# EAGLE design RFWBBoard (EAGLE 6.1)
AUTHOR: Benjamin Babjak; AUTHOREMAIL: benjamin.babjak@vanderbilt.edu; PAGE1: Cover page; PAGE2: Connector; PAGE3: Baseband signals; PAGE4: RF signals; PAGE5: Control/Digital signals; PAGE6: Clock; PAGE7: Supply; REVIEWER1: Peter Volgyesi; REVIEWER2: Sandor Szilvasi; REVIEWEREMAIL1: peter.volgyesi@vanderbilt.edu; REVIEWEREMAIL2: sandor.szilvasi@vanderbilt.edu; REVISION: A; TITLE: Joshua

## Sheet 1 of 7
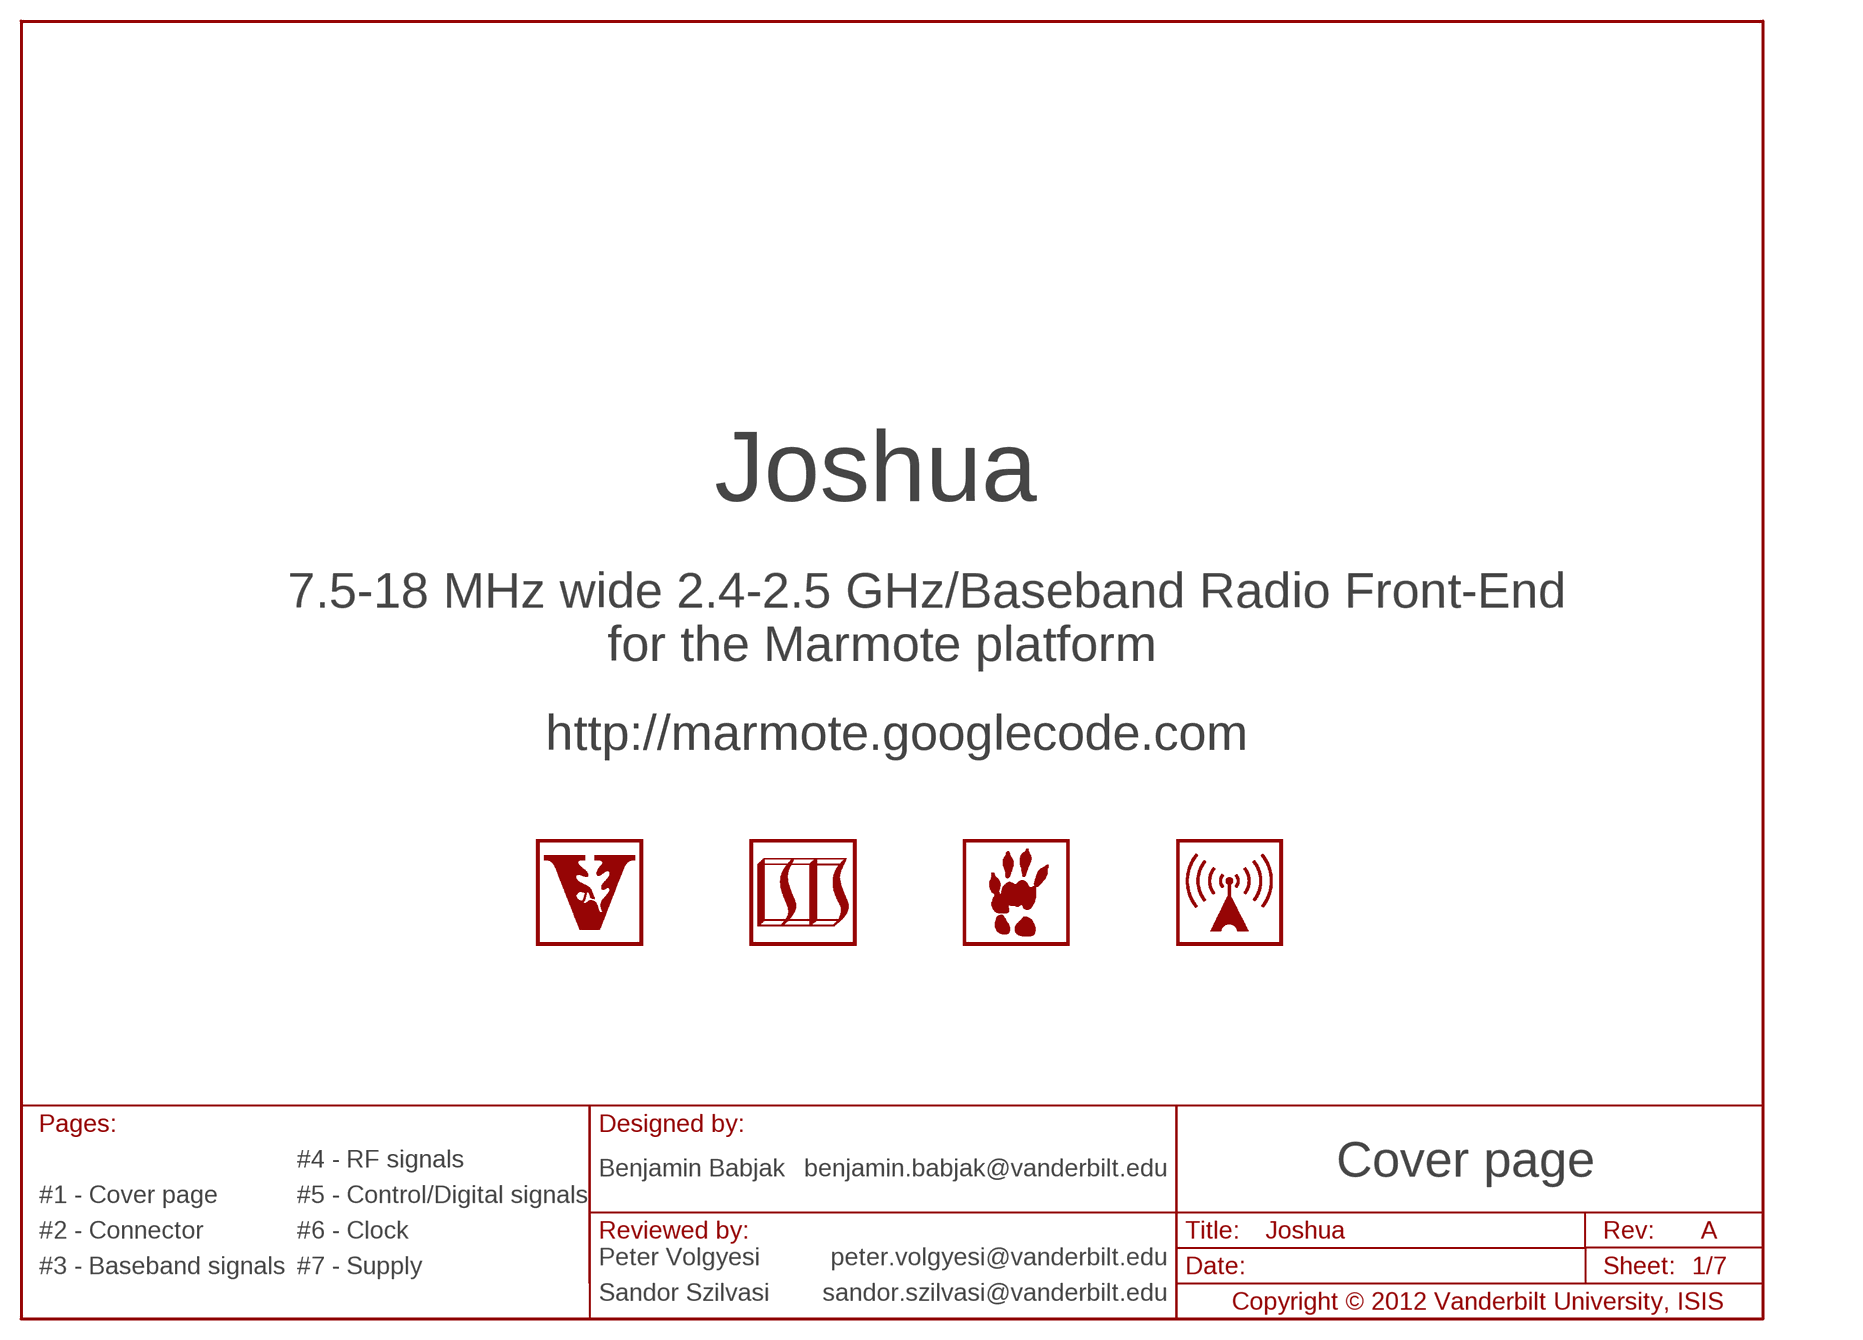
[diagram p0: schematic, sheet 1]

### Parts
LOGO4  LOGO-ISIS-600MIL-10MM-SS  [LOGO-ISIS-10MM-SILKSCREEN]
LOGO5  LOGO-VANDERBILT-600MIL-10MM-SS  [LOGO-VANDERBILT-10MM-SILKSCREEN]
LOGO6  LOGO-MARMOTE-600MIL-10MM-SS  [LOGO-MARMOTE-10MM-SILKSCREEN]
LOGO7  LOGO-RADIO-3-600MIL-10MM-SS  [LOGO-RADIO-FILLED-10MM-SILKSCREEN]

### Notes on the sheet
- 7.5-18 MHz wide 2.4-2.5 GHz/Baseband Radio Front-End
- for the Marmote platform
- http://marmote.googlecode.com

## Sheet 2 of 7
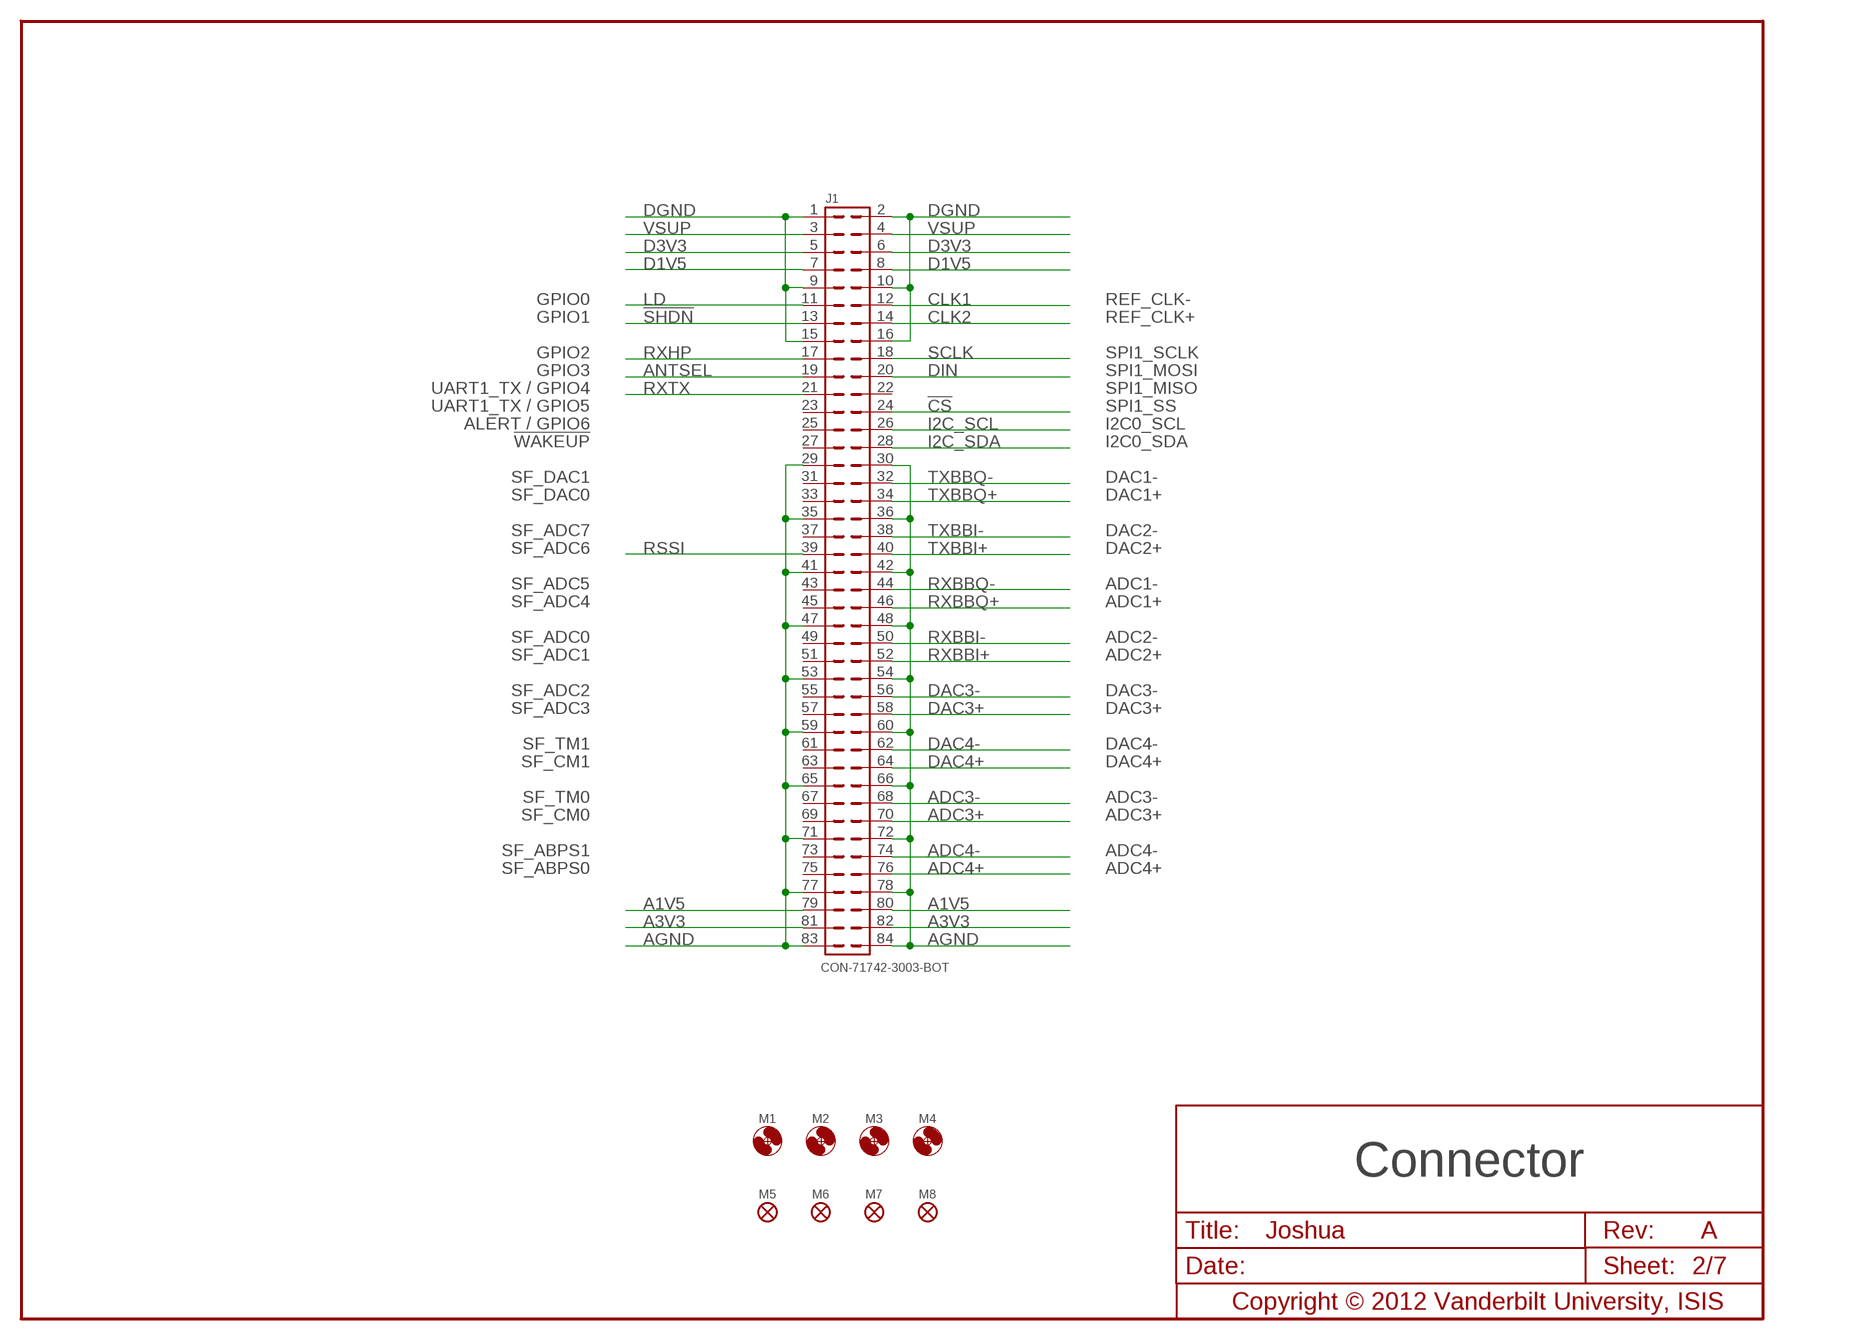
[diagram p1: schematic, sheet 2]

### Parts
J1  CON-71742-3003-BOT  [71742-3003-BOT]
M1  MOUNT-HOLE3.3  [3,3]
M2  MOUNT-HOLE3.3  [3,3]
M3  MOUNT-HOLE3.3  [3,3]
M4  MOUNT-HOLE3.3  [3,3]
M5  FIDUCIAL1X2  [FIDUCIAL-1X2]
M6  FIDUCIAL1X2  [FIDUCIAL-1X2]
M7  FIDUCIAL1X2  [FIDUCIAL-1X2]
M8  FIDUCIAL1X2  [FIDUCIAL-1X2]

### Nets
!CS: J1.24 ; also sheet 5
!SHDN: J1.13 ; also sheet 5
A1V5: J1.79 J1.80
A3V3: J1.81 J1.82 ; also sheet 3,6,7
ADC3+: J1.70 ; also sheet 3
ADC3-: J1.68 ; also sheet 3
ADC4+: J1.76 ; also sheet 3
ADC4-: J1.74 ; also sheet 3
AGND: J1.29 J1.30 J1.35 J1.36 J1.41 J1.42 J1.47 J1.48 J1.53 J1.54 J1.59 J1.60 J1.65 J1.66 J1.71 J1.72 J1.77 J1.78 J1.83 J1.84 ; also sheet 3,4,6,7
ANTSEL: J1.19 ; also sheet 5
CLK1: J1.12 ; also sheet 6
CLK2: J1.14 ; also sheet 6
D1V5: J1.7 J1.8
D3V3: J1.5 J1.6 ; also sheet 5
DAC3+: J1.58 ; also sheet 3
DAC3-: J1.56 ; also sheet 3
DAC4+: J1.64 ; also sheet 3
DAC4-: J1.62 ; also sheet 3
DGND: J1.1 J1.2 J1.9 J1.10 J1.15 J1.16 ; also sheet 5,6,7
DIN: J1.20 ; also sheet 5
I2C_SCL: J1.26 ; also sheet 5
I2C_SDA: J1.28 ; also sheet 5
LD: J1.11 ; also sheet 6
RSSI: J1.39 ; also sheet 5
RXBBI+: J1.52 ; also sheet 4
RXBBI-: J1.50 ; also sheet 4
RXBBQ+: J1.46 ; also sheet 4
RXBBQ-: J1.44 ; also sheet 4
RXHP: J1.17 ; also sheet 5
RXTX: J1.21 ; also sheet 5
SCLK: J1.18 ; also sheet 5
TXBBI+: J1.40 ; also sheet 4
TXBBI-: J1.38 ; also sheet 4
TXBBQ+: J1.34 ; also sheet 4
TXBBQ-: J1.32 ; also sheet 4
VSUP: J1.3 J1.4
Unconnected: J1.22 J1.23 J1.25 J1.27 J1.31 J1.33 J1.37 J1.43 J1.45 J1.49 J1.51 J1.55 J1.57 J1.61 J1.63 J1.67 J1.69 J1.73 J1.75

### Notes on the sheet
- GPIO0 | REF_CLK-
- GPIO1 | REF_CLK+
- GPIO2 | SPI1_SCLK
- GPIO3 | SPI1_MOSI
- UART1_TX / GPIO4 | SPI1_MISO
- UART1_TX / GPIO5 | SPI1_SS
- ALERT / GPIO6 | I2C0_SCL
- !WAKEUP | I2C0_SDA
- SF_DAC1 | DAC1-
- SF_DAC0 | DAC1+
- SF_ADC7 | DAC2-
- SF_ADC6 | DAC2+
- SF_ADC5 | ADC1-
- SF_ADC4 | ADC1+
- SF_ADC0 | ADC2-
- SF_ADC1 | ADC2+
- SF_ADC2 | DAC3-
- SF_ADC3 | DAC3+
- SF_TM1 | DAC4-
- SF_CM1 | DAC4+
- SF_TM0 | ADC3-
- SF_CM0 | ADC3+
- SF_ABPS1 | ADC4-
- SF_ABPS0 | ADC4+

## Sheet 3 of 7
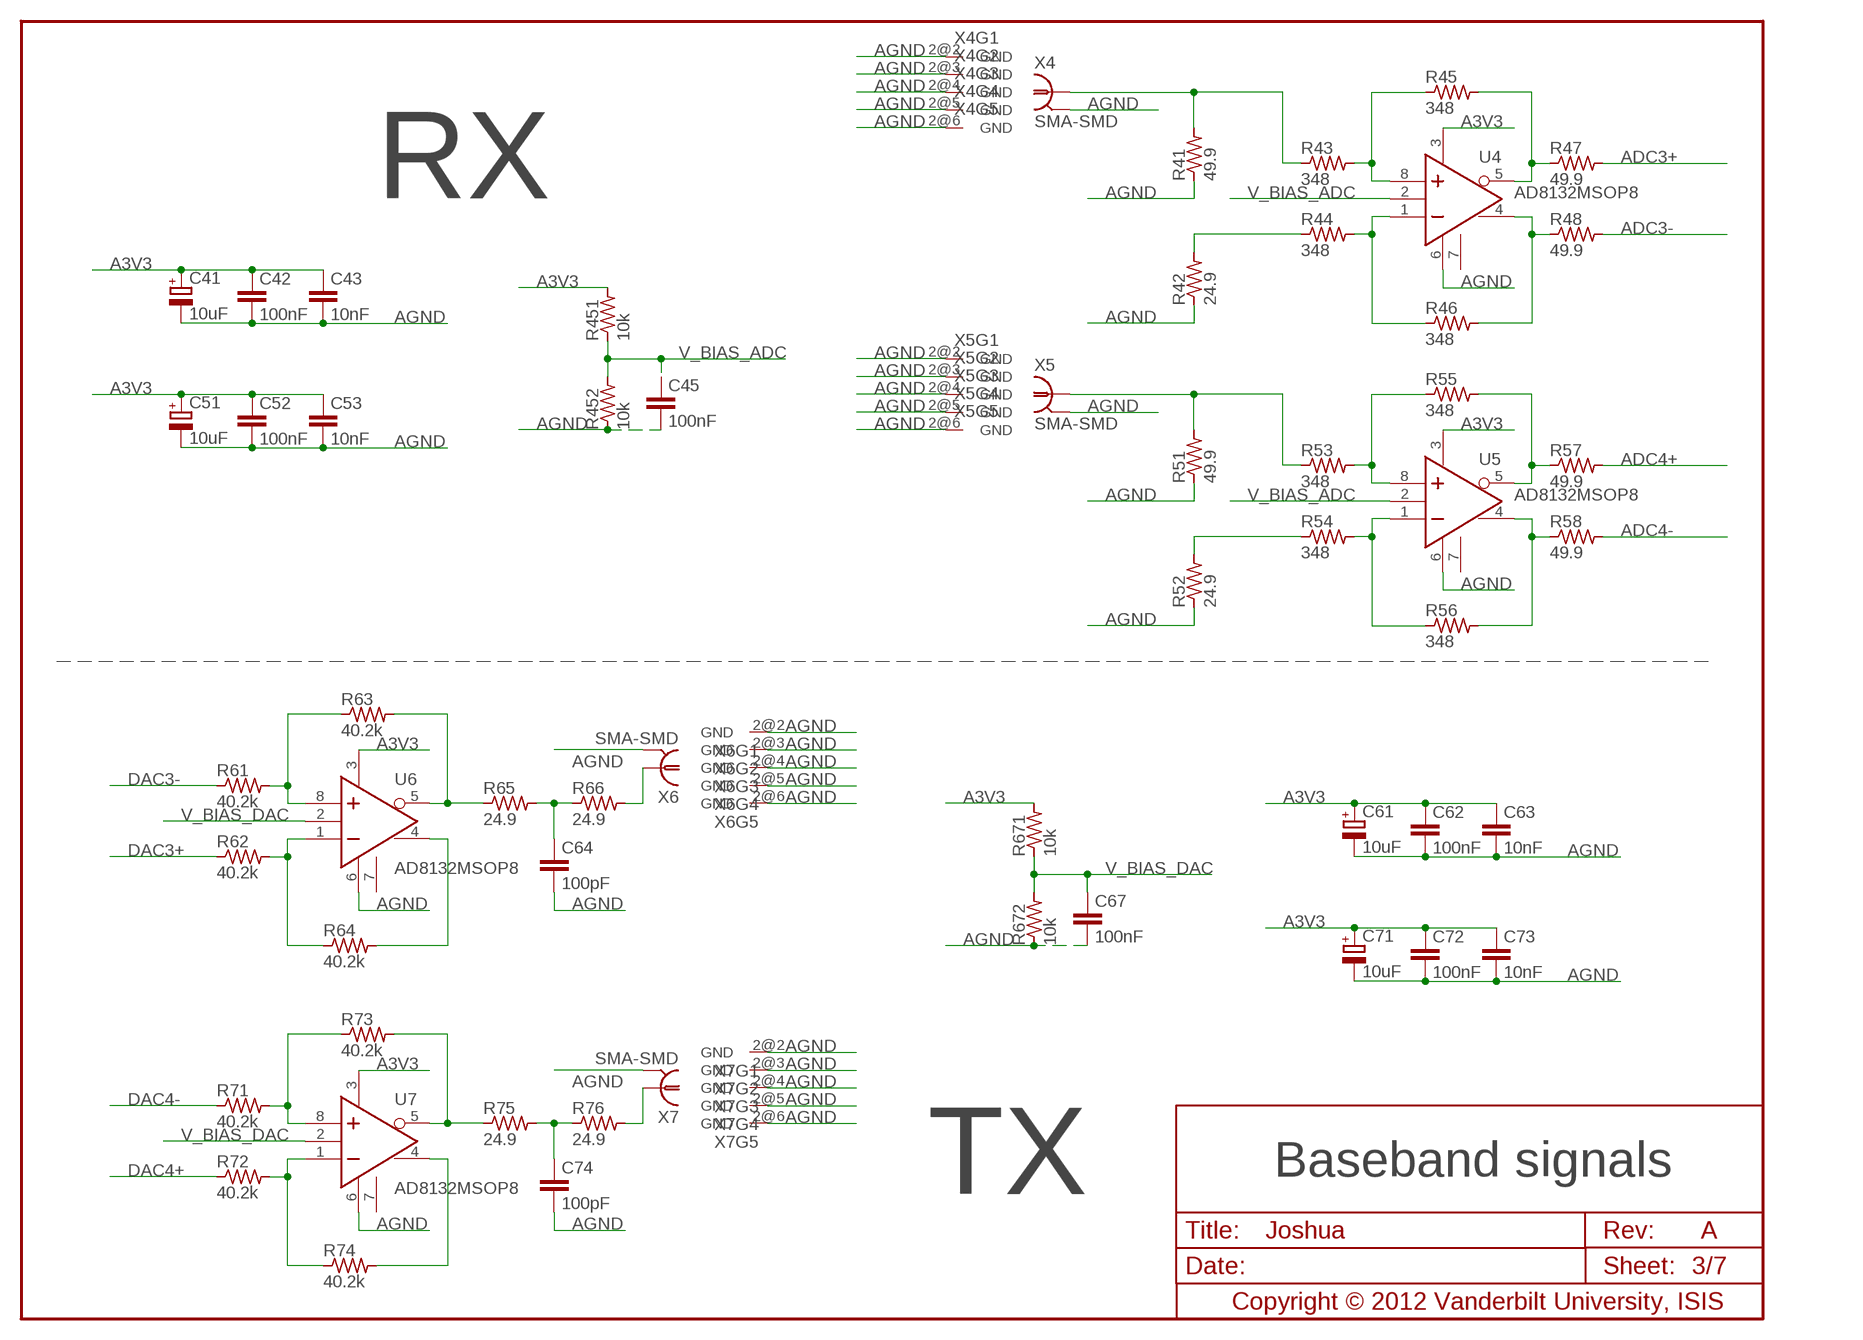
[diagram p2: schematic, sheet 3]

### Parts
C41  10uF  CPOL2012  [CPOL2012]
C42  100nF  C0402  [C0402]
C43  10nF  C0402  [C0402]
C45  100nF  C0402  [C0402]
C51  10uF  CPOL2012  [CPOL2012]
C52  100nF  C0402  [C0402]
C53  10nF  C0402  [C0402]
C61  10uF  CPOL2012  [CPOL2012]
C62  100nF  C0402  [C0402]
C63  10nF  C0402  [C0402]
C64  100pF  C0402  [C0402]
C67  100nF  C0402  [C0402]
C71  10uF  CPOL2012  [CPOL2012]
C72  100nF  C0402  [C0402]
C73  10nF  C0402  [C0402]
C74  100pF  C0402  [C0402]
R41  49.9  R0402  [R0402]
R42  24.9  R0402  [R0402]
R43  348  R0402  [R0402]
R44  348  R0402  [R0402]
R45  348  R0402  [R0402]
R46  348  R0402  [R0402]
R47  49.9  R0402  [R0402]
R48  49.9  R0402  [R0402]
R51  49.9  R0402  [R0402]
R52  24.9  R0402  [R0402]
R53  348  R0402  [R0402]
R54  348  R0402  [R0402]
R55  348  R0402  [R0402]
R56  348  R0402  [R0402]
R57  49.9  R0402  [R0402]
R58  49.9  R0402  [R0402]
R61  40.2k  R0402  [R0402]
R62  40.2k  R0402  [R0402]
R63  40.2k  R0402  [R0402]
R64  40.2k  R0402  [R0402]
R65  24.9  R0402  [R0402]
R66  24.9  R0402  [R0402]
R71  40.2k  R0402  [R0402]
R72  40.2k  R0402  [R0402]
R73  40.2k  R0402  [R0402]
R74  40.2k  R0402  [R0402]
R75  24.9  R0402  [R0402]
R76  24.9  R0402  [R0402]
R451  10k  R0402  [R0402]
R452  10k  R0402  [R0402]
R671  10k  R0402  [R0402]
R672  10k  R0402  [R0402]
U4  AD8132MSOP8  [MSOP8]
U5  AD8132MSOP8  [MSOP8]
U6  AD8132MSOP8  [MSOP8]
U7  AD8132MSOP8  [MSOP8]
X4  SMA-SMD  [SMA-SMD]
X5  SMA-SMD  [SMA-SMD]
X6  SMA-SMD  [SMA-SMD]
X7  SMA-SMD  [SMA-SMD]

### Nets
A3V3: C41.+ C42.1 C43.1 C51.+ C52.1 C53.1 C61.+ C62.1 C63.1 C71.+ C72.1 C73.1 R451.2 R671.2 U4.3(V_S+) U5.3(V_S+) U6.3(V_S+) U7.3(V_S+) ; also sheet 2,6,7
ADC3+: R47.2 ; also sheet 2
ADC3-: R48.2 ; also sheet 2
ADC4+: R57.2 ; also sheet 2
ADC4-: R58.2 ; also sheet 2
AGND: C41.- C42.2 C43.2 C45.2 C51.- C52.2 C53.2 C61.- C62.2 C63.2 C64.2 C67.2 C71.- C72.2 C73.2 C74.2 R41.1 R42.1 R51.1 R52.1 R452.1 R672.1 U4.6(V_S-) U5.6(V_S-) U6.6(V_S-) U7.6(V_S-) X4.2@1(GND) X4.2@2(GND) X4.2@3(GND) X4.2@4(GND) X4.2@5(GND) X4.2@6(GND) X5.2@1(GND) X5.2@2(GND) X5.2@3(GND) X5.2@4(GND) X5.2@5(GND) X5.2@6(GND) X6.2@1(GND) X6.2@2(GND) X6.2@3(GND) X6.2@4(GND) X6.2@5(GND) X6.2@6(GND) X7.2@1(GND) X7.2@2(GND) X7.2@3(GND) X7.2@4(GND) X7.2@5(GND) X7.2@6(GND) ; also sheet 2,4,6,7
DAC3+: R62.1 ; also sheet 2
DAC3-: R61.1 ; also sheet 2
DAC4+: R72.1 ; also sheet 2
DAC4-: R71.1 ; also sheet 2
N$11: R41.2 R43.1 X4.1
N$12: R45.2 R47.1 U4.5(-OUT)
N$13: R46.2 R48.1 U4.4(+OUT)
N$14: R43.2 R45.1 U4.8(+IN)
N$15: R44.2 R46.1 U4.1(-IN)
N$16: R51.2 R53.1 X5.1
N$17: R42.2 R44.1
N$18: R55.2 R57.1 U5.5(-OUT)
N$19: R56.2 R58.1 U5.4(+OUT)
N$20: R53.2 R55.1 U5.8(+IN)
N$21: R54.2 R56.1 U5.1(-IN)
N$22: R52.2 R54.1
N$23: R61.2 R63.1 U6.8(+IN)
N$24: R62.2 R64.1 U6.1(-IN)
N$25: R63.2 R65.1 U6.5(-OUT)
N$26: R64.2 U6.4(+OUT)
N$27: C64.1 R65.2 R66.1
N$28: R71.2 R73.1 U7.8(+IN)
N$29: R66.2 X6.1
N$30: R72.2 R74.1 U7.1(-IN)
N$31: R73.2 R75.1 U7.5(-OUT)
N$32: R74.2 U7.4(+OUT)
N$33: C74.1 R75.2 R76.1
N$34: R76.2 X7.1
V_BIAS_ADC: C45.1 R451.1 R452.2 U4.2(V_OCM) U5.2(V_OCM)
V_BIAS_DAC: C67.1 R671.1 R672.2 U6.2(V_OCM) U7.2(V_OCM)
Unconnected: U4.7(PD) U5.7(PD) U6.7(PD) U7.7(PD)

### Notes on the sheet
- RX
- TX

## Sheet 4 of 7
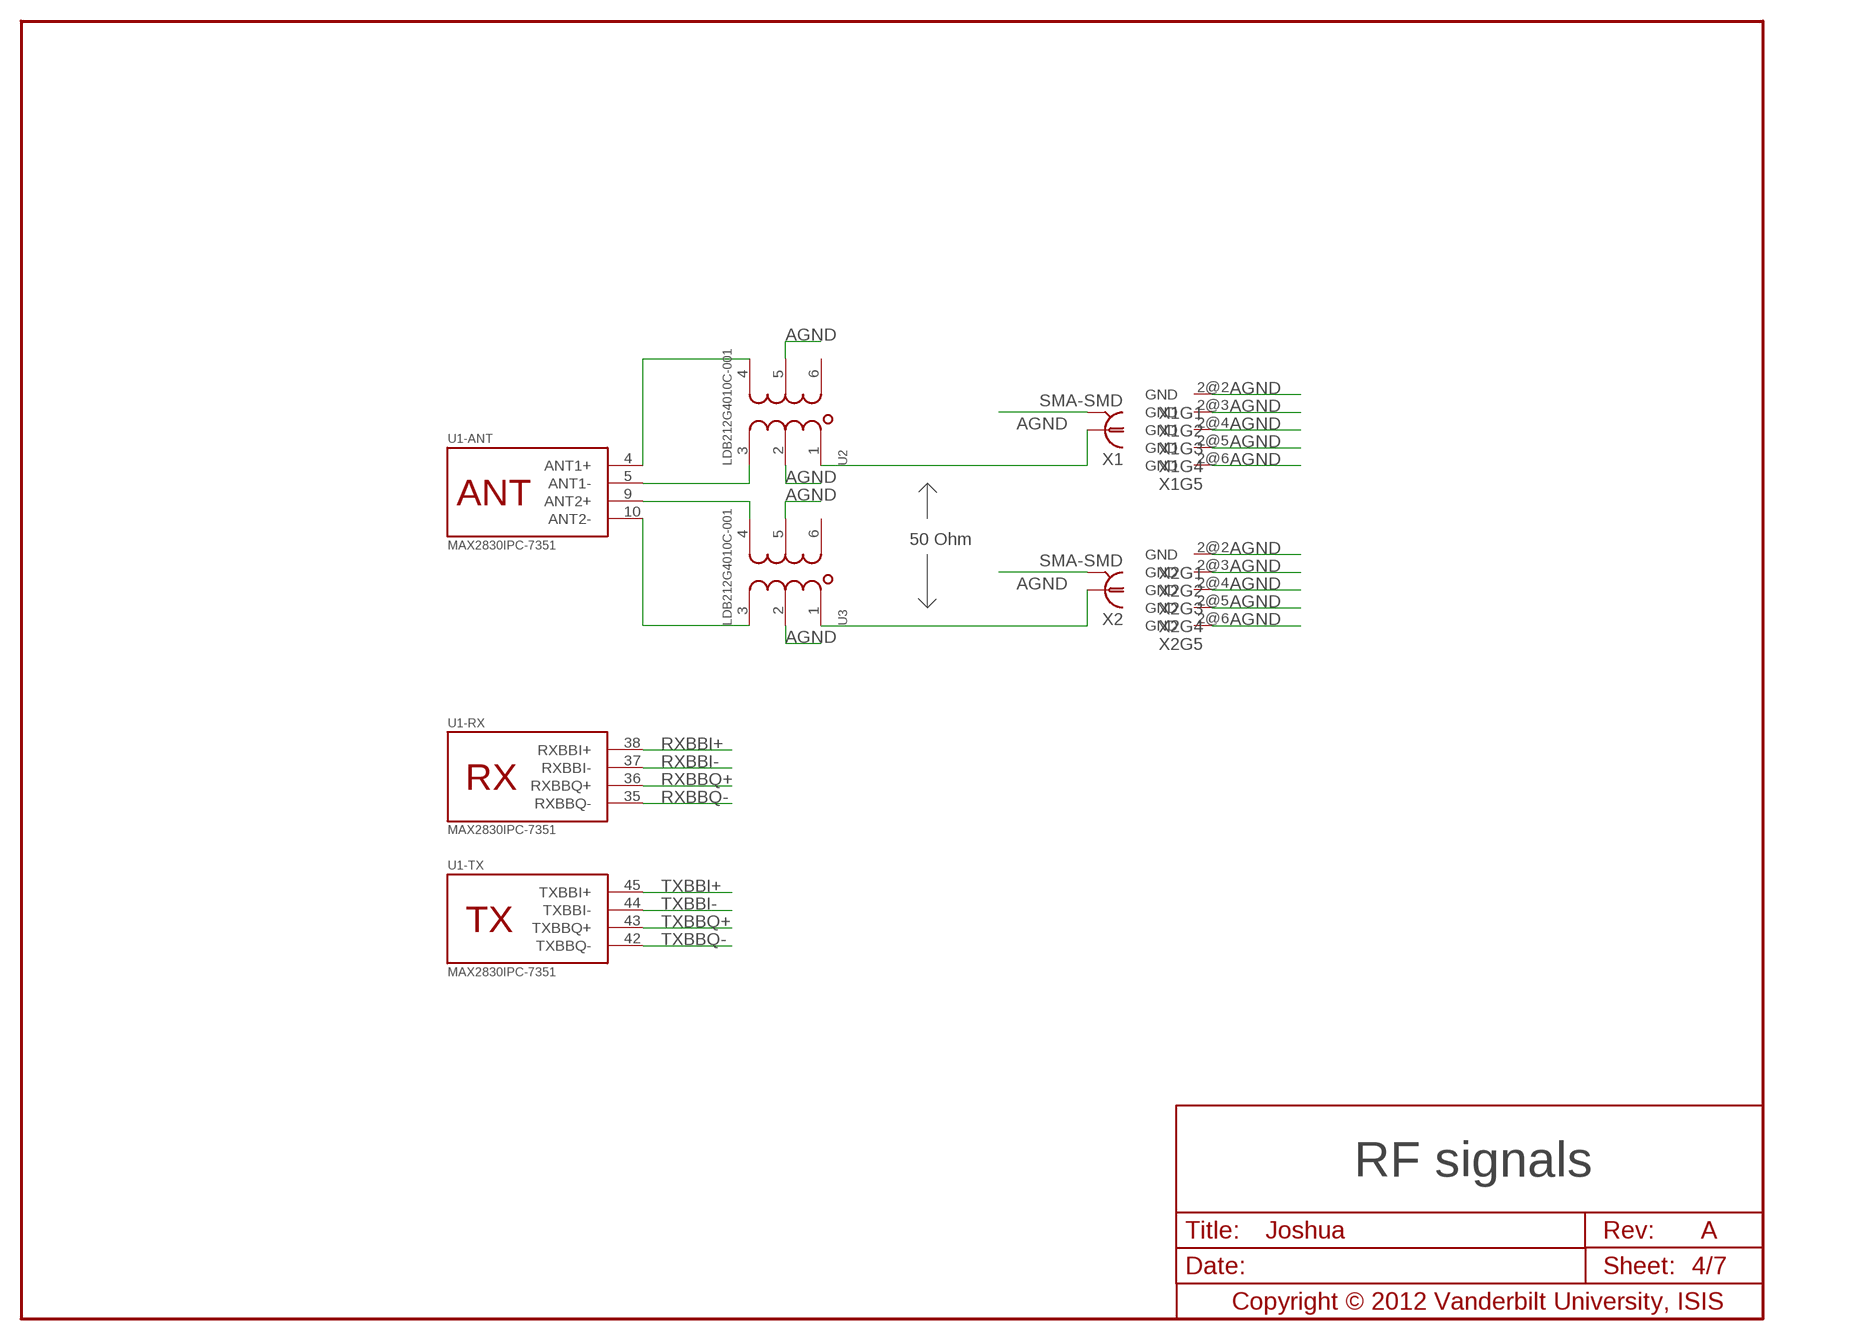
[diagram p3: schematic, sheet 4]

### Parts
U1  MAX2830IPC-7351  [TQFN-48]
U2  LDB212G4010C-001  [LDB21-FOOTPRINT]
U3  LDB212G4010C-001  [LDB21-FOOTPRINT]
X1  SMA-SMD  [SMA-SMD]
X2  SMA-SMD  [SMA-SMD]

### Nets
AGND: U2.2 U2.5 U3.2 U3.5 X1.2@1(GND) X1.2@2(GND) X1.2@3(GND) X1.2@4(GND) X1.2@5(GND) X1.2@6(GND) X2.2@1(GND) X2.2@2(GND) X2.2@3(GND) X2.2@4(GND) X2.2@5(GND) X2.2@6(GND) ; also sheet 2,3,6,7
N$1: U1.4(-ANT:ANT1+) U2.4
N$2: U1.5(-ANT:ANT1-) U2.3
N$3: U1.10(-ANT:ANT2-) U3.3
N$4: U1.9(-ANT:ANT2+) U3.4
N$8: U2.1 X1.1
N$9: U3.1 X2.1
RXBBI+: U1.38(-RX:RXBBI+) ; also sheet 2
RXBBI-: U1.37(-RX:RXBBI-) ; also sheet 2
RXBBQ+: U1.36(-RX:RXBBQ+) ; also sheet 2
RXBBQ-: U1.35(-RX:RXBBQ-) ; also sheet 2
TXBBI+: U1.45(-TX:TXBBI+) ; also sheet 2
TXBBI-: U1.44(-TX:TXBBI-) ; also sheet 2
TXBBQ+: U1.43(-TX:TXBBQ+) ; also sheet 2
TXBBQ-: U1.42(-TX:TXBBQ-) ; also sheet 2
Unconnected: U2.6 U3.6

### Notes on the sheet
- 50 Ohm

## Sheet 5 of 7
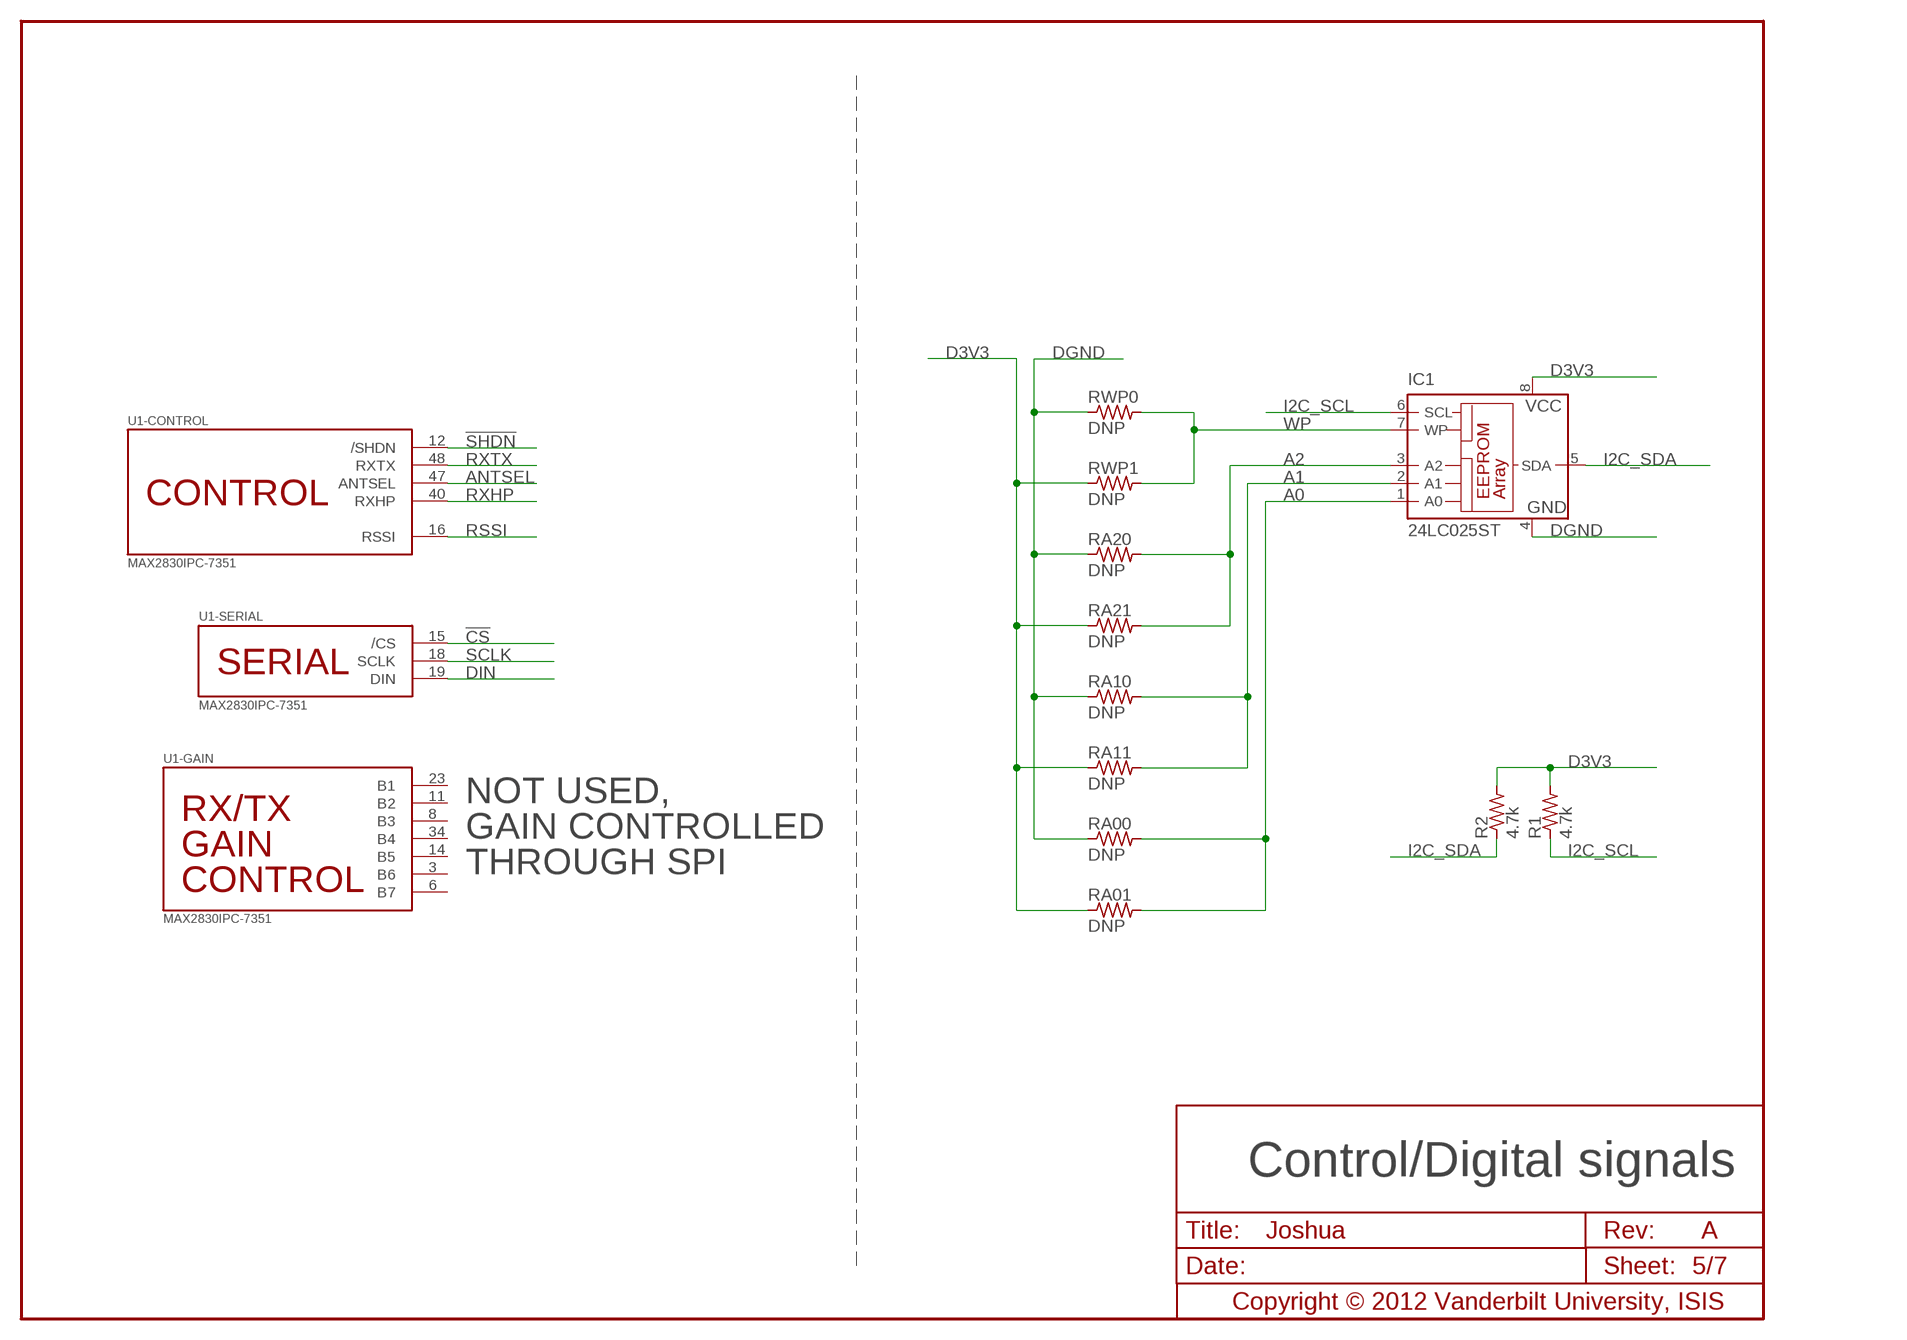
[diagram p4: schematic, sheet 5]

### Parts
IC1  24LC025ST  [TSSOP8]
R1  4.7k  R0402  [R0402]
R2  4.7k  R0402  [R0402]
RA00  DNP  R0402  [R0402]
RA01  DNP  R0402  [R0402]
RA10  DNP  R0402  [R0402]
RA11  DNP  R0402  [R0402]
RA20  DNP  R0402  [R0402]
RA21  DNP  R0402  [R0402]
RWP0  DNP  R0402  [R0402]
RWP1  DNP  R0402  [R0402]

### Nets
!CS: U1.15(-SERIAL:/CS) ; also sheet 2
!SHDN: U1.12(-CONTROL:/SHDN) ; also sheet 2
A0: IC1.1(A0) RA00.2 RA01.2
A1: IC1.2(A1) RA10.2 RA11.2
A2: IC1.3(A2) RA20.2 RA21.2
ANTSEL: U1.47(-CONTROL:ANTSEL) ; also sheet 2
D3V3: IC1.8(VCC) R1.2 R2.2 RA01.1 RA11.1 RA21.1 RWP1.1 ; also sheet 2
DGND: IC1.4(GND) RA00.1 RA10.1 RA20.1 RWP0.1 ; also sheet 2,6,7
DIN: U1.19(-SERIAL:DIN) ; also sheet 2
I2C_SCL: IC1.6(SCL) R1.1 ; also sheet 2
I2C_SDA: IC1.5(SDA) R2.1 ; also sheet 2
RSSI: U1.16(-CONTROL:RSSI) ; also sheet 2
RXHP: U1.40(-CONTROL:RXHP) ; also sheet 2
RXTX: U1.48(-CONTROL:RXTX) ; also sheet 2
SCLK: U1.18(-SERIAL:SCLK) ; also sheet 2
WP: IC1.7(WP) RWP0.2 RWP1.2
Unconnected: U1.3(-GAIN:B6) U1.6(-GAIN:B7) U1.8(-GAIN:B3) U1.11(-GAIN:B2) U1.14(-GAIN:B5) U1.23(-GAIN:B1) U1.34(-GAIN:B4)

### Notes on the sheet
- NOT USED,
- GAIN CONTROLLED
- THROUGH SPI

## Sheet 6 of 7
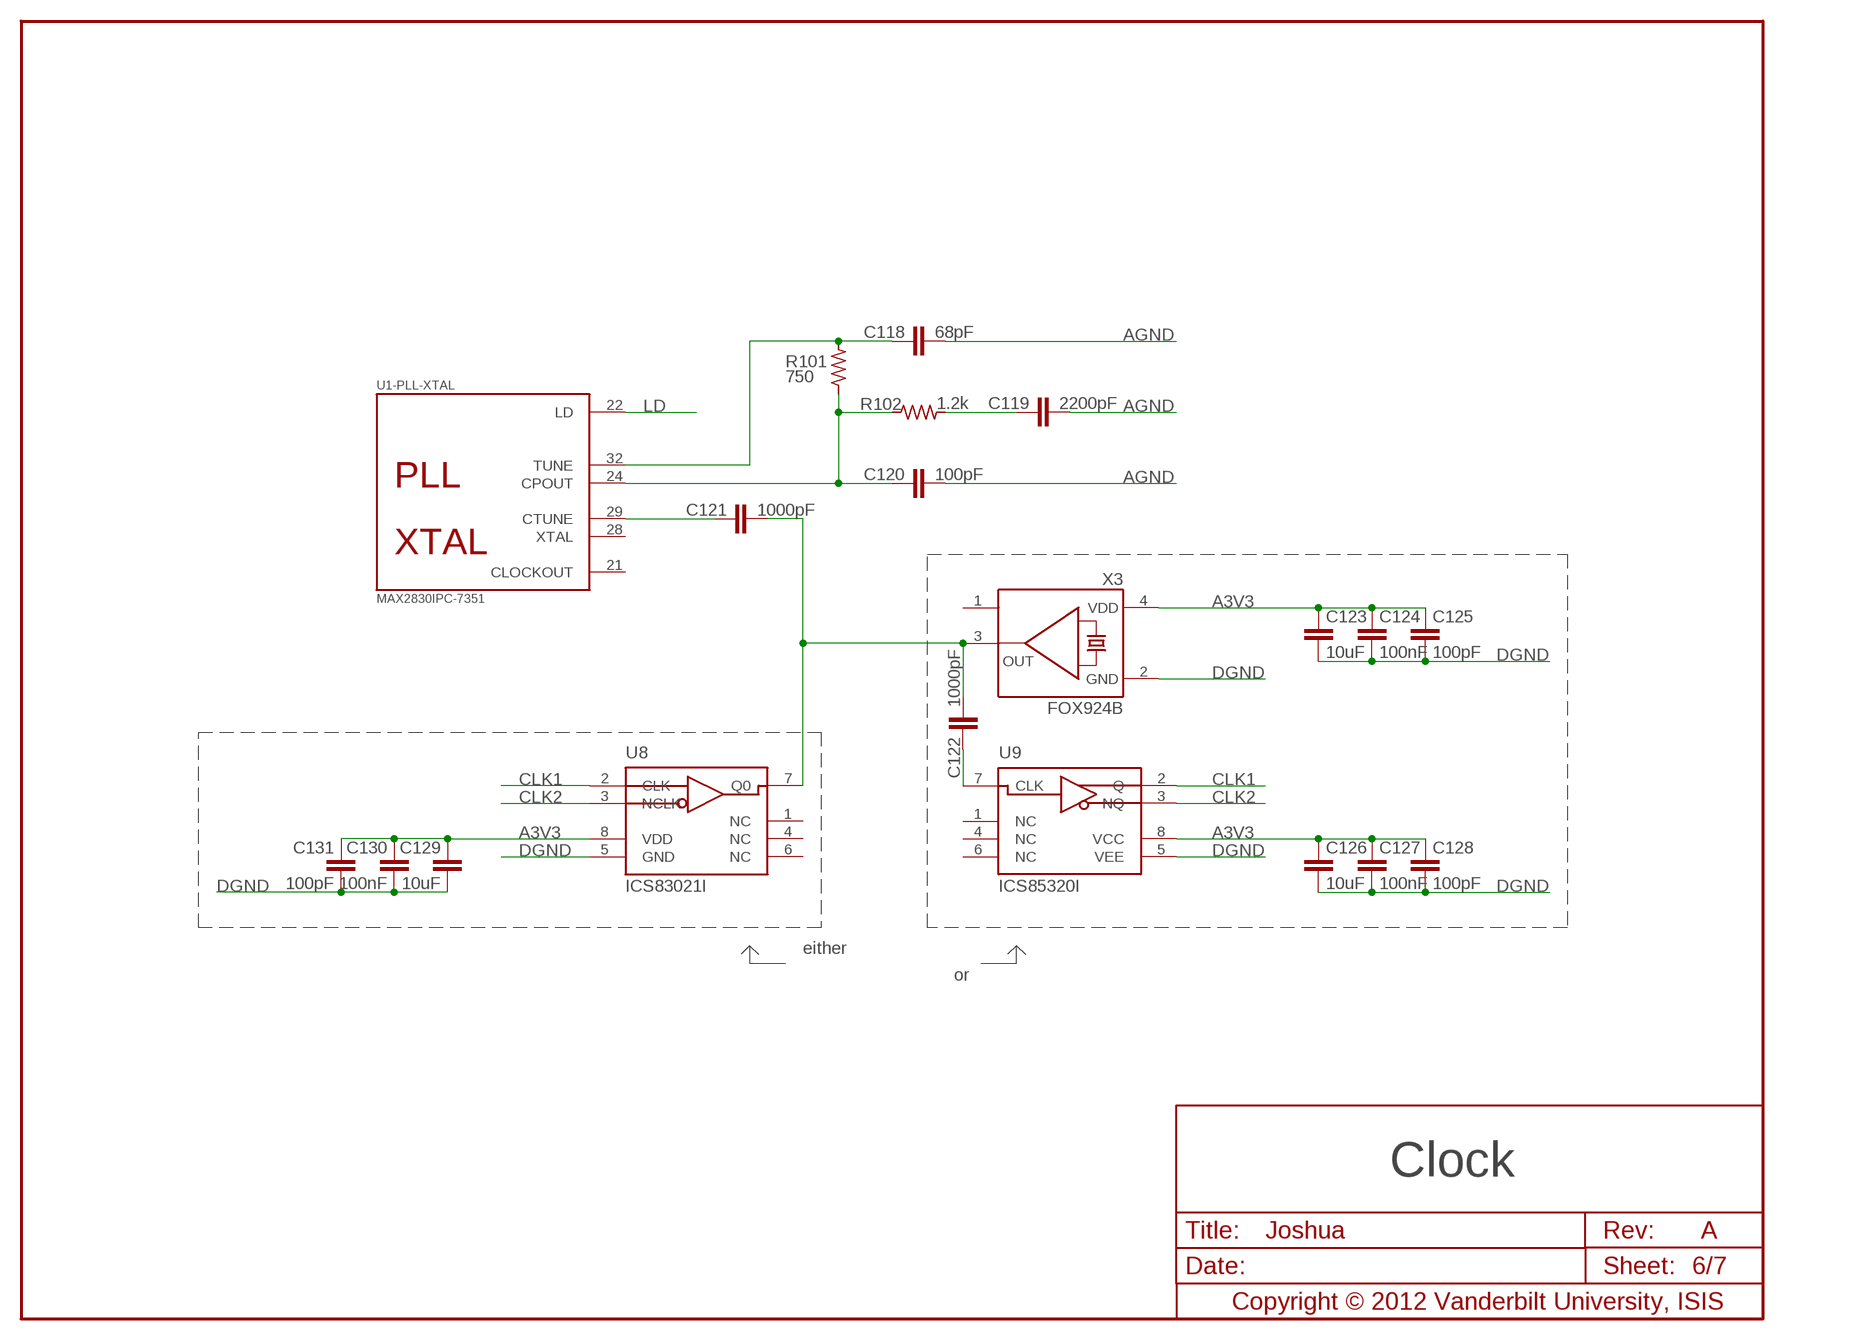
[diagram p5: schematic, sheet 6]

### Parts
C118  68pF  C0402  [C0402]
C119  2200pF  C0402  [C0402]
C120  100pF  C0402  [C0402]
C121  1000pF  C0402  [C0402]
C122  1000pF  C0402  [C0402]
C123  10uF  C0805  [C0805]
C124  100nF  C0402  [C0402]
C125  100pF  C0402  [C0402]
C126  10uF  C0805  [C0805]
C127  100nF  C0402  [C0402]
C128  100pF  C0402  [C0402]
C129  10uF  C0805  [C0805]
C130  100nF  C0402  [C0402]
C131  100pF  C0402  [C0402]
R101  750  R0402  [R0402]
R102  1.2k  R0402  [R0402]
U8  ICS83021I  [SOIC8]
U9  ICS85320I  [SOIC8]
X3  FOX924B  [FOX924]

### Nets
A3V3: C123.1 C124.1 C125.1 C126.1 C127.1 C128.1 C129.1 C130.1 C131.1 U8.8(VDD) U9.8(VCC) X3.4(VCC) ; also sheet 2,3,7
AGND: C118.2 C119.2 C120.2 ; also sheet 2,3,4,7
CLK1: U8.2(CLK) U9.2(Q) ; also sheet 2
CLK2: U8.3(NCLK) U9.3(NQ) ; also sheet 2
DGND: C123.2 C124.2 C125.2 C126.2 C127.2 C128.2 C129.2 C130.2 C131.2 U8.5(GND) U9.5(VEE) X3.2(GND) ; also sheet 2,5,7
LD: U1.22(-PLL-XTAL:LD) ; also sheet 2
N$5: C118.1 R101.2 U1.32(-PLL-XTAL:TUNE)
N$6: C121.1 U1.29(-PLL-XTAL:CTUNE)
N$7: C119.1 R102.2
N$10: C120.1 R101.1 R102.1 U1.24(-PLL-XTAL:CPOUT)
N$36: C121.2 C122.2 U8.7(Q0) X3.3(FO)
N$39: C122.1 U9.7(CLK)
Unconnected: U1.21(-PLL-XTAL:CLOCKOUT) U1.28(-PLL-XTAL:XTAL) U8.1(NC) U8.4(NC) U8.6(NC) U9.1(NC) U9.4(NC) U9.6(NC) X3.1(NC)

### Notes on the sheet
- either
- or

## Sheet 7 of 7
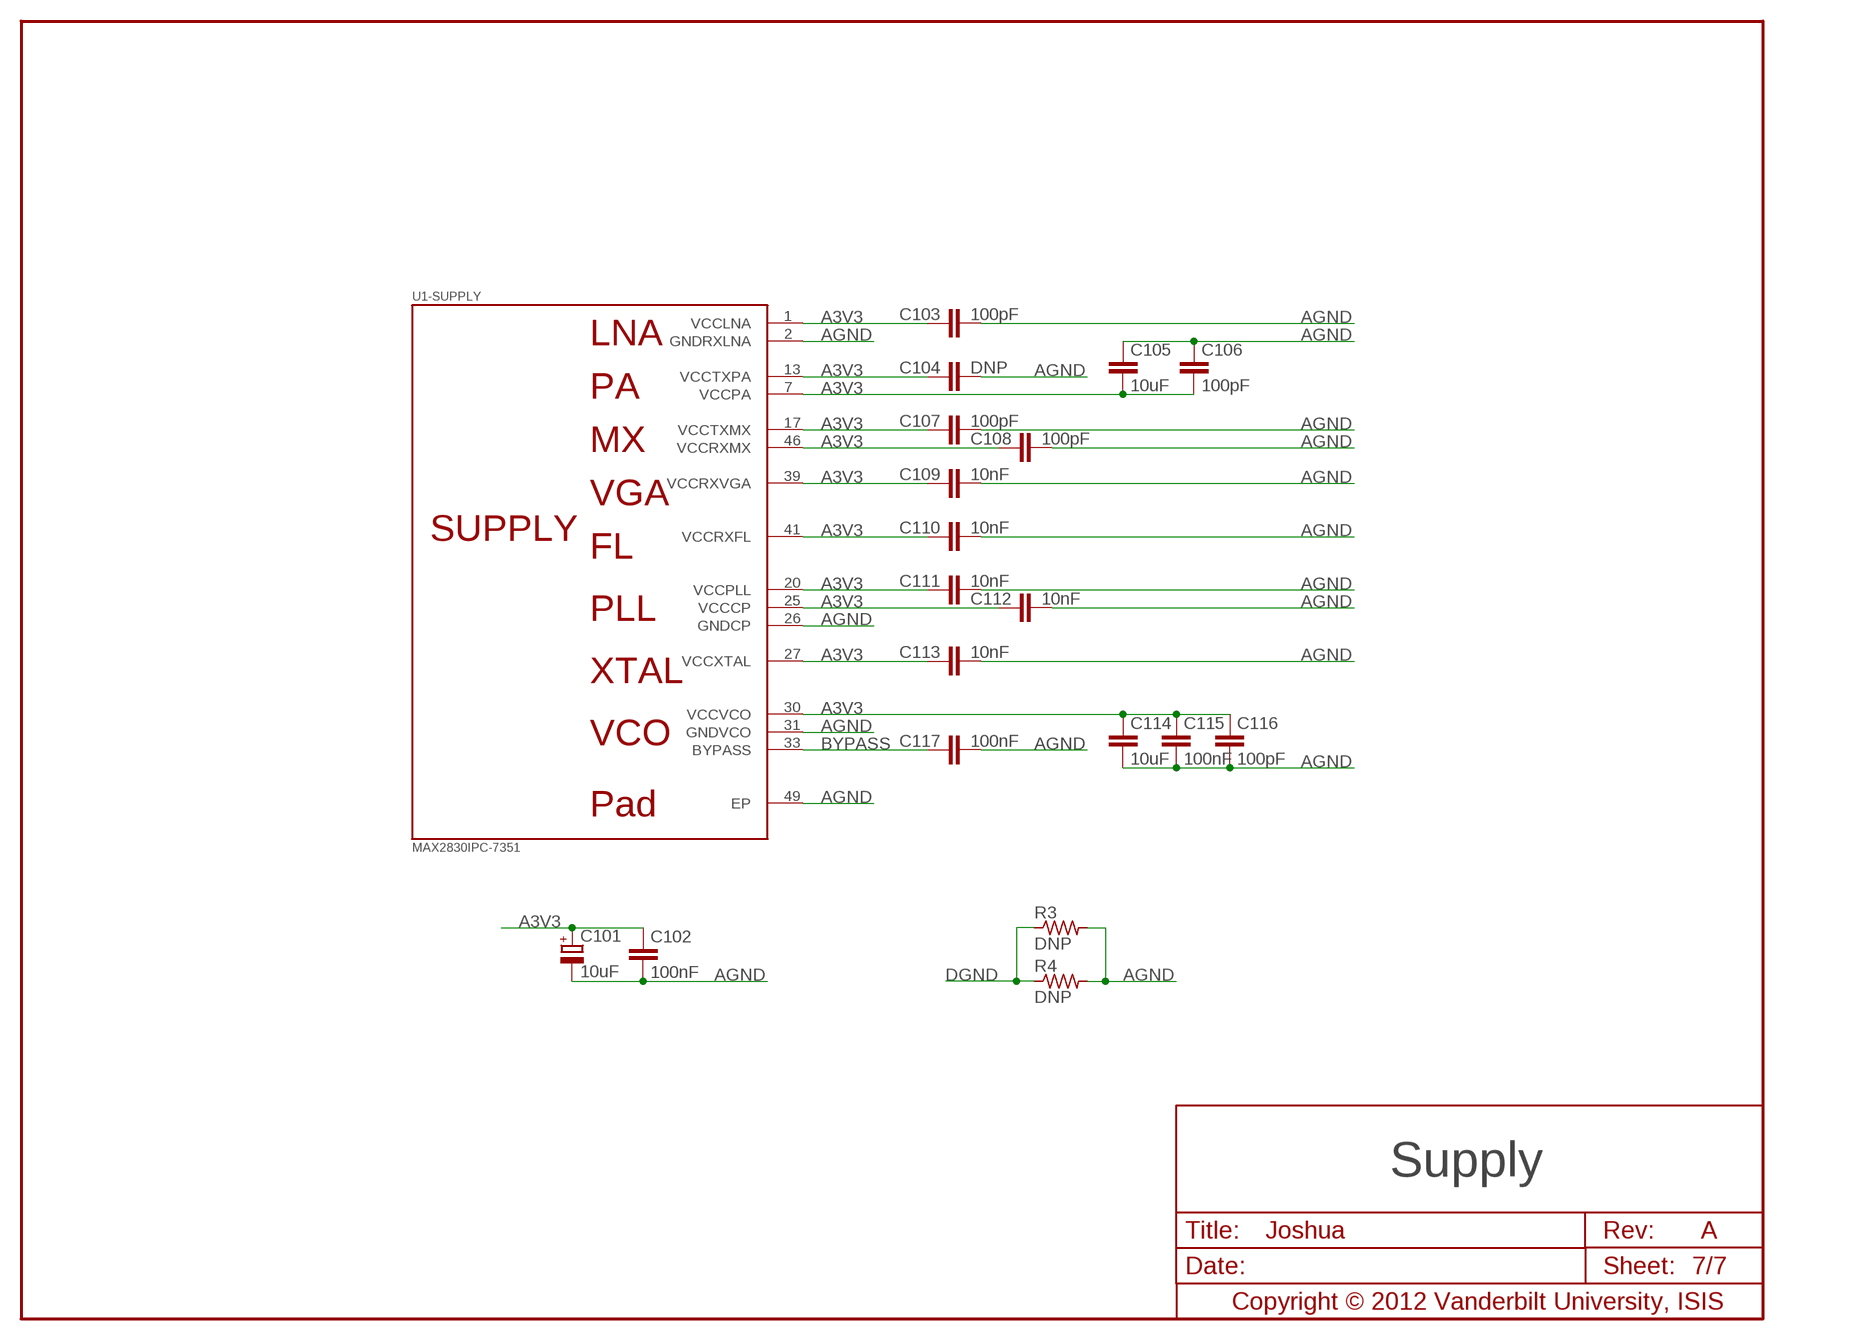
[diagram p6: schematic, sheet 7]

### Parts
C101  10uF  CPOL2012  [CPOL2012]
C102  100nF  C0402  [C0402]
C103  100pF  C0402  [C0402]
C104  DNP  C0402  [C0402]
C105  10uF  C1206  [C1206]
C106  100pF  C0402  [C0402]
C107  100pF  C0402  [C0402]
C108  100pF  C0402  [C0402]
C109  10nF  C0402  [C0402]
C110  10nF  C0402  [C0402]
C111  10nF  C0402  [C0402]
C112  10nF  C0402  [C0402]
C113  10nF  C0402  [C0402]
C114  10uF  C0805  [C0805]
C115  100nF  C0402  [C0402]
C116  100pF  C0402  [C0402]
C117  100nF  C0402  [C0402]
R3  DNP  R0603  [R0603]
R4  DNP  R0603  [R0603]

### Nets
A3V3: C101.+ C102.1 C103.1 C104.1 C105.2 C106.2 C107.1 C108.1 C109.1 C110.1 C111.1 C112.1 C113.1 C114.1 C115.1 C116.1 U1.1(-SUPPLY:VCCLNA) U1.7(-SUPPLY:VCCPA) U1.13(-SUPPLY:VCCTXPA) U1.17(-SUPPLY:VCCTXMX) U1.20(-SUPPLY:VCCPLL) U1.25(-SUPPLY:VCCCP) U1.27(-SUPPLY:VCCXTAL) U1.30(-SUPPLY:VCCVCO) U1.39(-SUPPLY:VCCRXVGA) U1.41(-SUPPLY:VCCRXFL) U1.46(-SUPPLY:VCCRXMX) ; also sheet 2,3,6
AGND: C101.- C102.2 C103.2 C104.2 C105.1 C106.1 C107.2 C108.2 C109.2 C110.2 C111.2 C112.2 C113.2 C114.2 C115.2 C116.2 C117.2 R3.2 R4.2 U1.2(-SUPPLY:GNDRXLNA) U1.26(-SUPPLY:GNDCP) U1.31(-SUPPLY:GNDVCO) U1.49(-SUPPLY:EP) ; also sheet 2,3,4,6
BYPASS: C117.1 U1.33(-SUPPLY:BYPASS)
DGND: R3.1 R4.1 ; also sheet 2,5,6

## Library data of the parts
C41 C51 C61 C71 C101 = RFWBBoard:CPOL: POLARIZED CAPACITOR Tantalum capacitors
C42 C43 C45 C52 C53 C62-C64 C67 C72-C74 C102-C131 = RFWBBoard:C: CAPACITOR
IC1 = RFWBBoard:24*: Serial EEPROM I2C; MF: MICROCHIP; MPN: 24LC025-I/ST; OC_FARNELL: unknown; OC_NEWARK: 92C7100
J1 = RFWBBoard:CON-71742: Board-to-Board Connector 1.00mm (.039") Mezzanine IEEE 1386 Receptacle - Dual Row 64-pin, SMT, Vertical Stacking Source: http://www.molex.com/molex/products/datasheet.jsp?part=active/0714392164_PCB_RECEPTACLES.xml&channel=Products
LOGO4 = Logo:LOGO-ISIS-600MIL: ISIS Logo Official logo of the Institute for Software Integrated Systems (ISIS), Vanderbilt as of 2011 Generated from 360 x 360 px bitmap and scaled to 600 x 600 mil v1.0 Initial design
LOGO5 = Logo:LOGO-VANDERBILT-600MIL: Vanderbilt Logo Official Framed Vanderbilt Logo Generated from 360 x 360 px bitmap and scaled to 600 x 600 mil v1.1 Source bitmap smoothened v1.0 Initial design
LOGO6 = Logo:LOGO-MARMOTE-600MIL: Marmote Platform Logo Preliminary logo for the Marmote Platform (http://marmote.googlecode.com) Generated from 360 x 360 px bitmap and scaled to 600 x 600 mil v1.1 Source bitmap smoothened v1.0 Initial design
LOGO7 = Logo:LOGO-RADIO-3-600MIL: Radio Logo Preliminary logo for the Marmote platform analog radio front-end module. Generated from 360 x 360 px bitmap and scaled to 600 x 600 mil v1.0 Initial design
M1-M4 = RFWBBoard:MOUNT-HOLE: MOUNTING HOLE with drill center marker
M5-M8 = RFWBBoard:FIDUCIAL: Fiducial Alignment Points Various fiducial points for machine vision alignment.
R1-R4 R41-R48 R51-R58 R61-R66 R71-R76 R101 R102 R451 R452 R671 R672 RA00 RA01 RA10 RA11 RA20 RA21 RWP0 RWP1 = RFWBBoard:R: RESISTOR
U1 = RFWBBoard:MAX2830: The MAX2830 direct conversion, zero-IF, RF transceiver is designed specifically for 2.4GHz to 2.5GHz 802.11g/b WLAN applications. The MAX2830 completely integrates all circuitry required to implement the RF transceiver function, providing an RF power amplifier (PA), an Rx/Tx and antenna diversity switch, RF-to-baseband receive path, baseband-to-RF transmit path, voltage-controlled oscillator (VCO), frequency synthesizer, crystal oscillator, and baseband/control interface. The MAX2830 includes a fast-settling sigma-delta RF synthesizer with smaller than 20Hz frequency steps and a digitally tuned crystal oscillator allowing use of a low-cost crystal. No I/Q calibration is required; however, the device also integrates on-chip DC-offset cancellation and I/Q errors and carrier leakage-detection circuits for improved performance. Only an RF bandpass filter (BPF), crystal, a pair of baluns, and a small number of passive components are needed to form a complete 802.11g/b WLAN RF front-end solution. http://www.maxim-ic.com/datasheet/index.mvp/id/5367/t/al http://datasheets.maxim-ic.com/en/ds/MAX2830.pdf
U2 U3 = RFWBBoard:LDB212G4010C-001: Murata Electronics LDB212G4010C-001 Chip Multilayer Hybrid Balun 6-Pin
U4-U7 = RFWBBoard:AD8132
U8 = RFWBBoard:ICS83021I: ICS83021I 1-to-1 differential-to-LVCMOS/LVTTL translator Integrated Device Technology The ICS83021I is a 1-to-1 Differential-to-LVCMOS/LVTTL Translator and a member of the HiPerClockS™ family of High Performance Clock Solutions from IDT. The differential input is highly flexible and can accept the following input types: LVPECL, LVDS, LVHSTL, SSTL, and HCSL. The small 8-lead SOIC footprint makes this device ideal for use in applications with limited board space. One LVCMOS/LVTTL output Differential CLK/nCLK input pair CLK/nCLK pair can accept the following differential input levels: LVPECL, LVDS, LVHSTL, SSTL, HCSL Output frequency: 350MHz (typical) Part-to-part skew: 500ps (maximum) Additive phase jitter, RMS: 0.21ps (typical), 3.3V output Full 3.3V and 2.5V operating supply -40°C to 85°C ambient operating temperature Available in both standard (RoHS 5) and lead-free (RoHS 6) packages Source: http://www.idt.com/sites/default/files/documents/IDT_83021I_DST_20100103.pdf
U9 = RFWBBoard:ICS85320I: ICS85320I LVCMOS/LVTTL-to-differential 3.3V, 2.5V LVPECL translator Integrated Device Technology The ICS85320I is a LVCMOS / LVTTL-to-Differential 3.3V, 2.5V LVPECL translator and a member of the HiPerClocks™ family of High Performance Clocks Solutions from IDT. The ICS85320I has a single ended clock input. The single ended clock input accepts LVCMOS or LVTTL input levels and translates them to 3.3V or 2.5V LVPECL levels. The small outline 8-pin SOIC package makes this device ideal for applications where space, high performance and low power are important. One differential 2.5V/3.3V LVPECL output LVCMOS/LVTTL CLK input CLK accepts the following input levels: LVCMOS or LVTTL Maximum output frequency: 267MHz Part-to-part skew: 275ps (maximum) Additive phase jitter, RMS: 0.05ps (typical) 3.3V operating supply voltage (operating range 3.135V to 3.465V) 2.5V operating supply voltage (operating range 2.375V to 2.625V) -40°C to 85°C ambient operating temperature Available in both standard (RoHS 5) and lead-free (RoHS 6) packages Source: http://www.idt.com/sites/default/files/documents/IDT_85320I_DST_20061113.pdf
X1 X2 X4-X7 = RFWBBoard:SMA-SMD: SMA 50 Ohm Straight Jack Receptacle - Surface Mount www.johnsoncomponents.com Source: http://catalog.digikey.com .. 142-0711-201, 205, 202, 206.pdf; OC_FARNELL: unknown; OC_NEWARK: unknown
X3 = RFWBBoard:FOX924B: FOX924B 3.3V SMD TCXO Compact 3.3 V ultra miniature SMD HCMOS temperature compenstated crystall oscillator (TCXO) in 5 x 3.2 x 1.5 mm package. Source: http://www.foxonline.com/pdfs/fox924.pdf; DIGI-KEY#: 631-1073-1-ND; FREQ: 20 MHz; MF: Fox Electronics; MPN: FOX924B-20.000

## Board
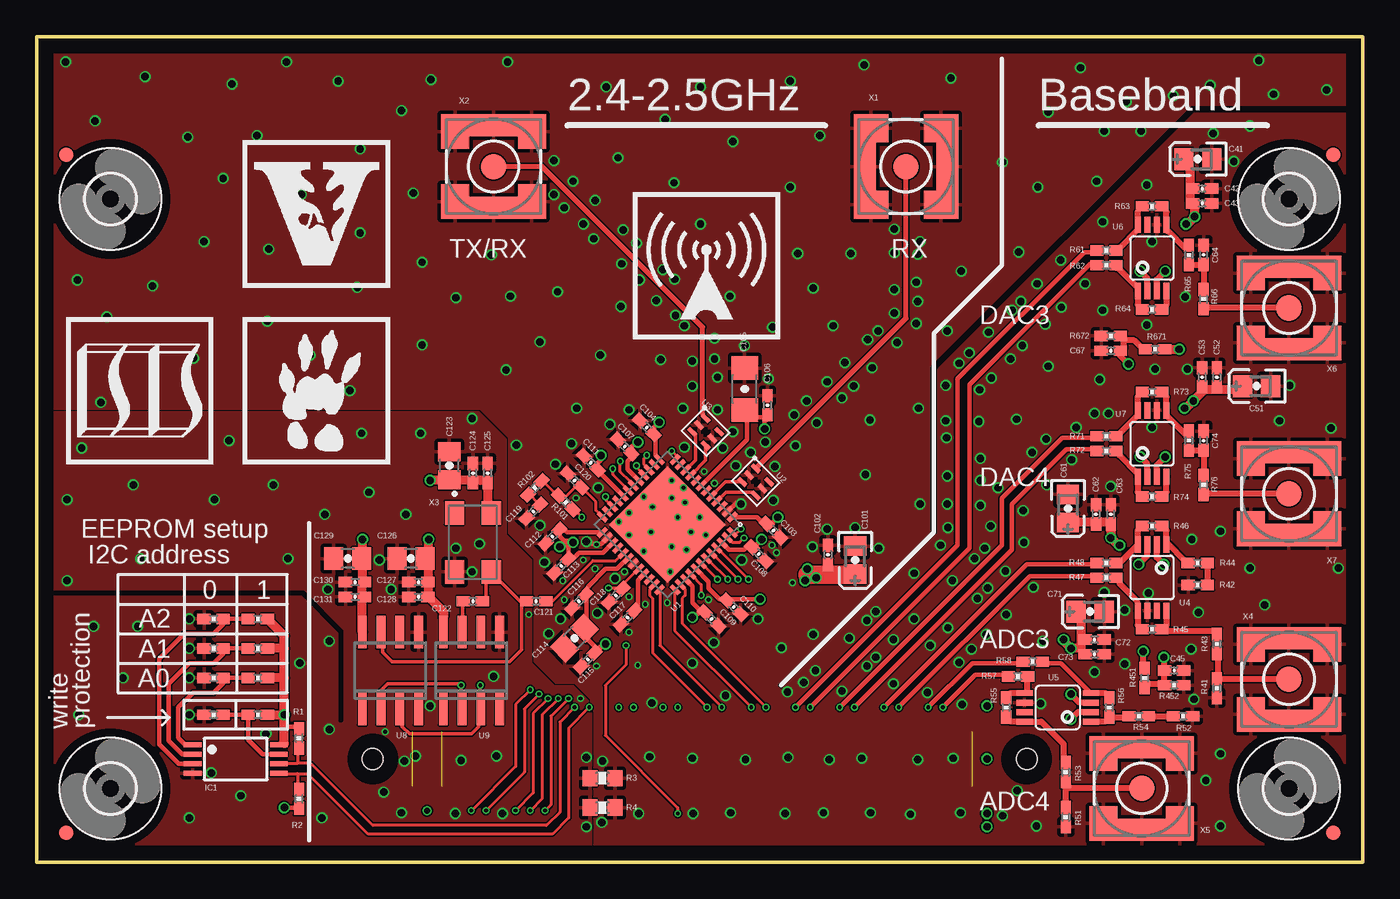
[diagram p7: board, top side]
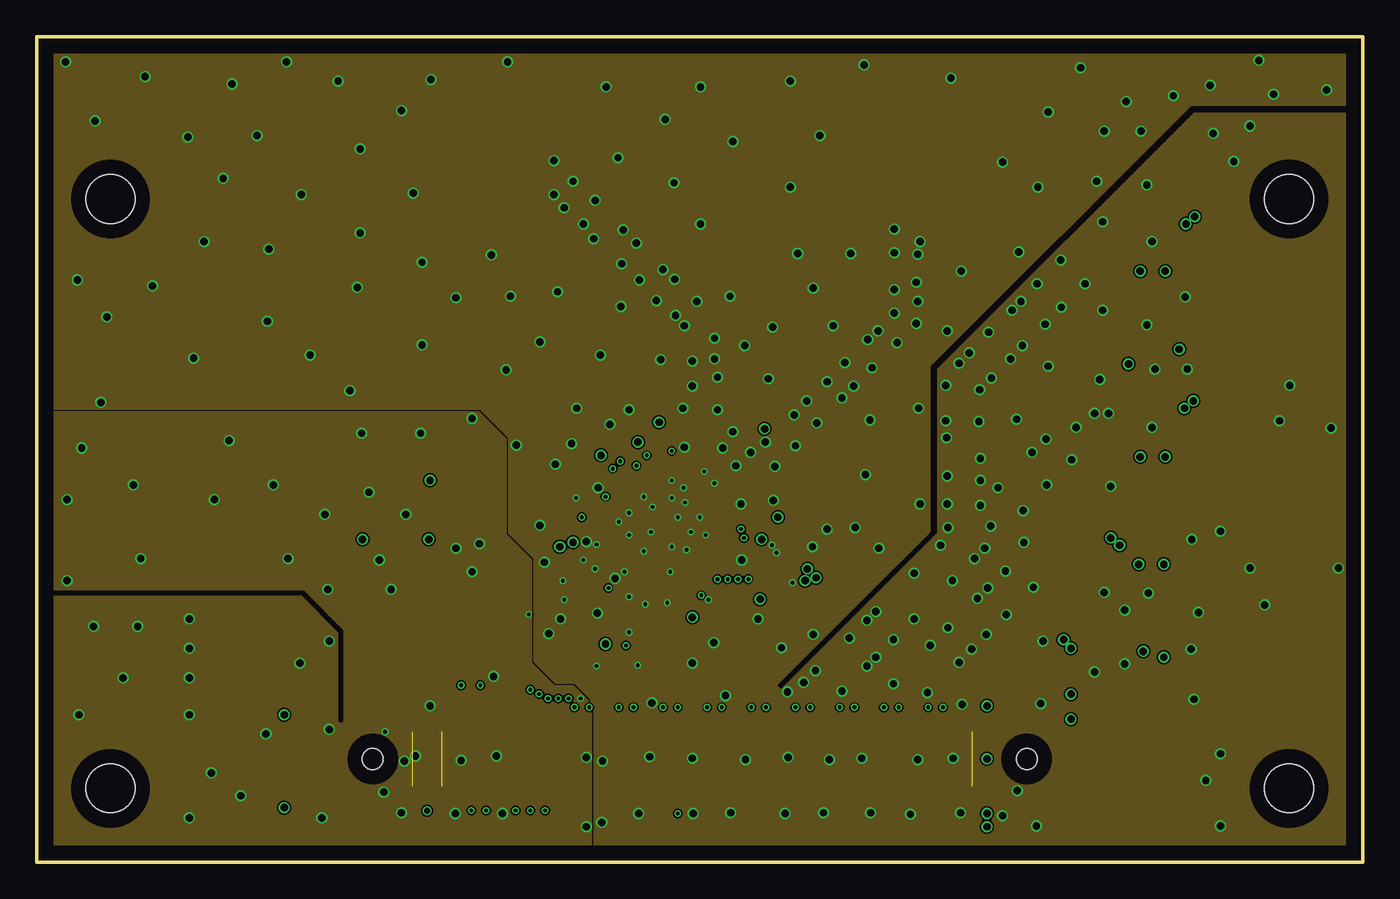
[diagram p8: board, inner layer GND1]
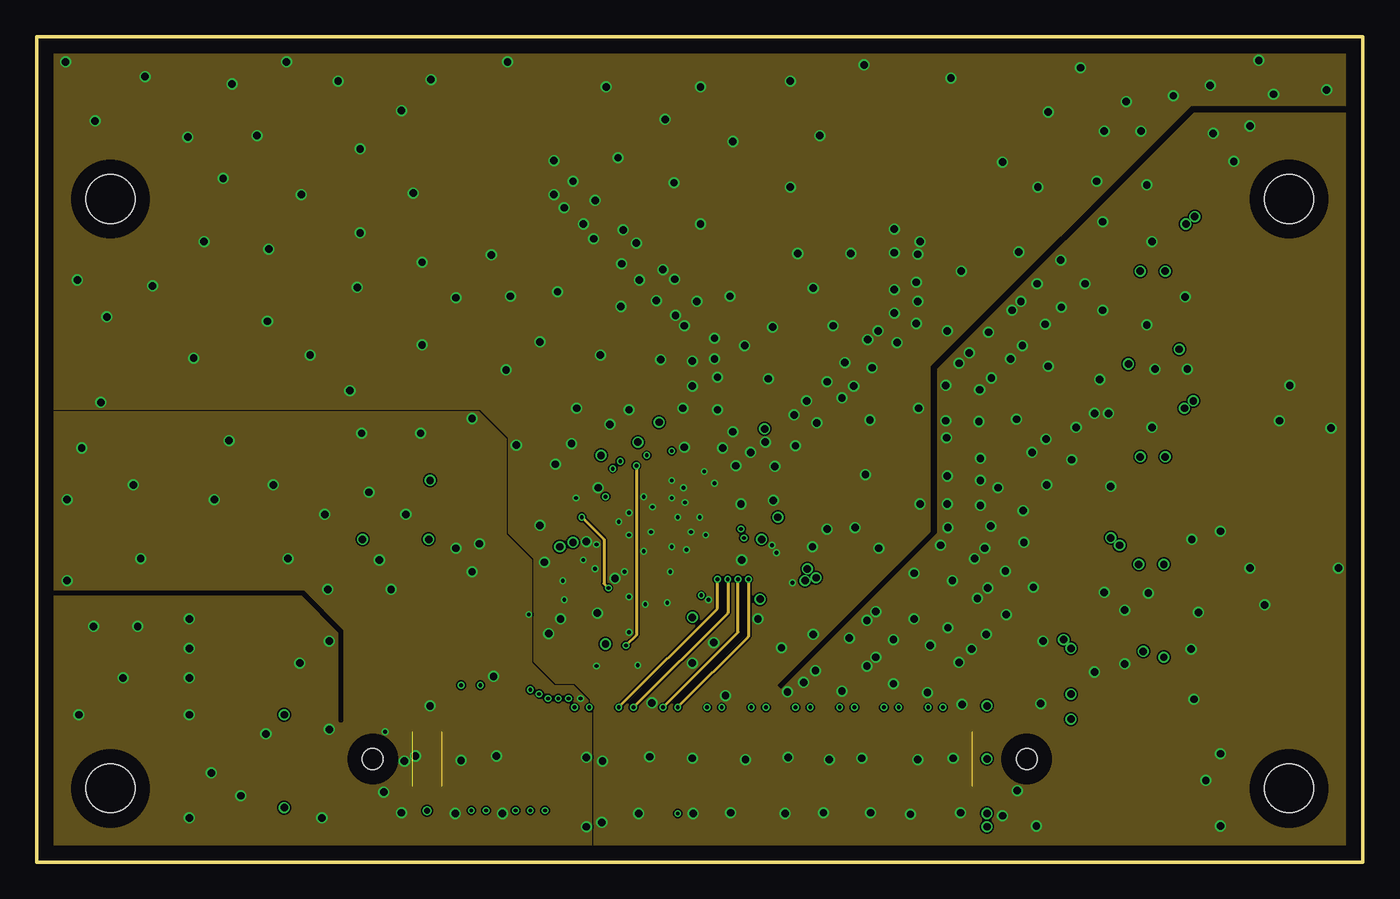
[diagram p9: board, inner layer SIGNAL2]
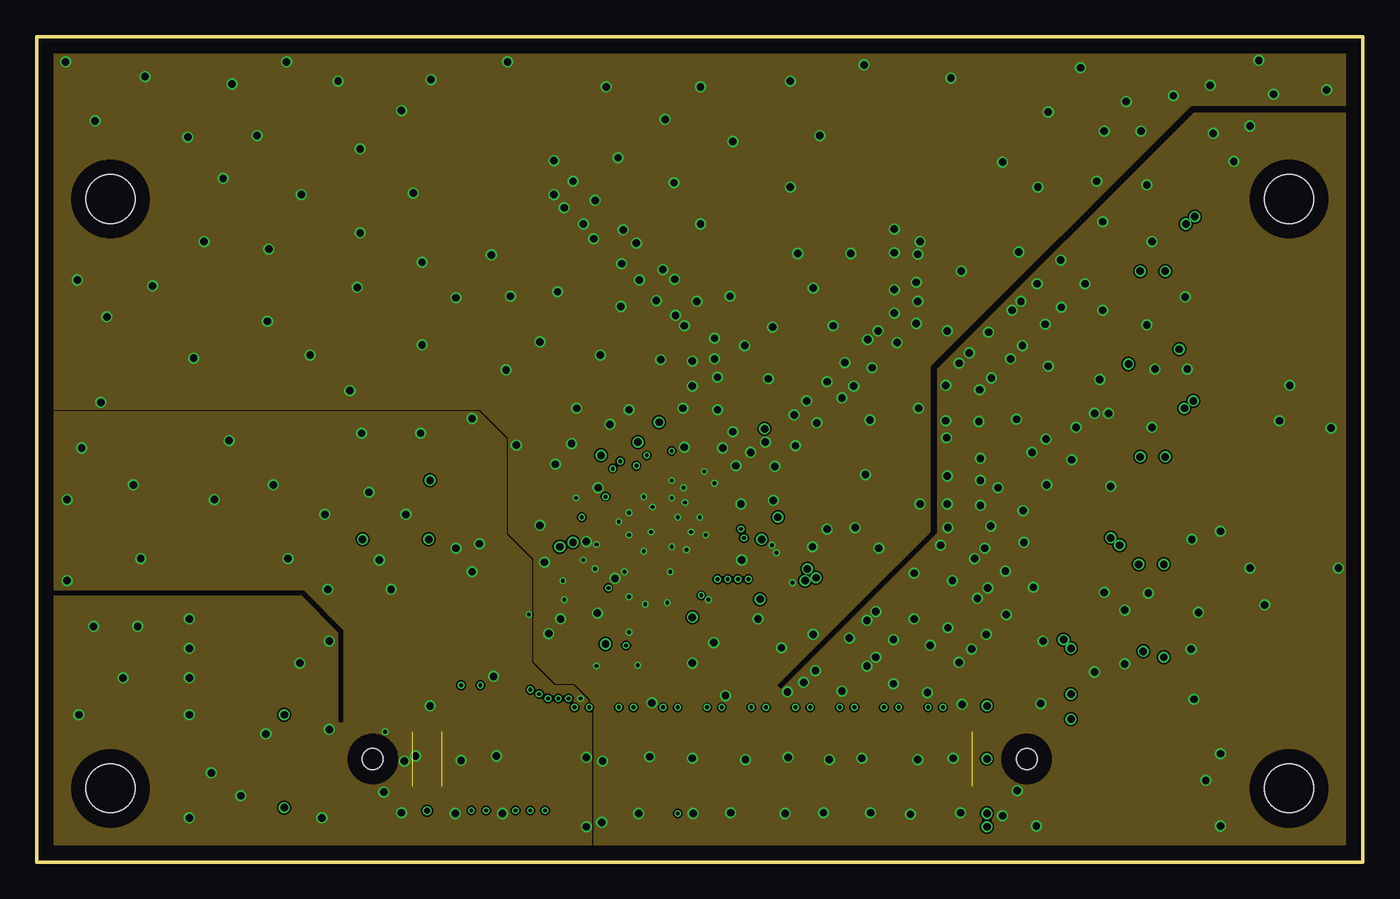
[diagram p10: board, inner layer GND2]
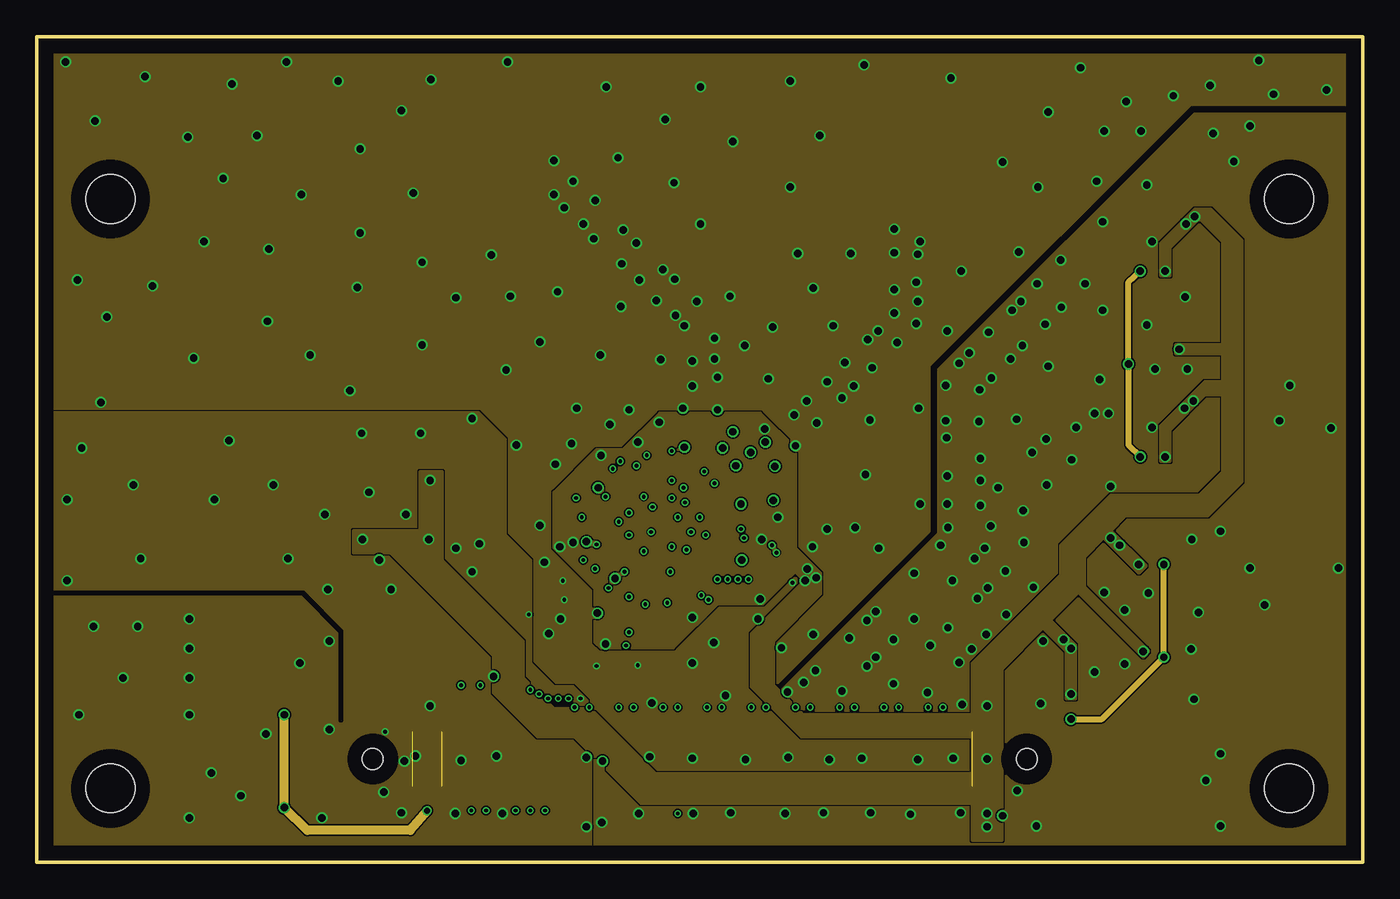
[diagram p11: board, inner layer SUPPLY]
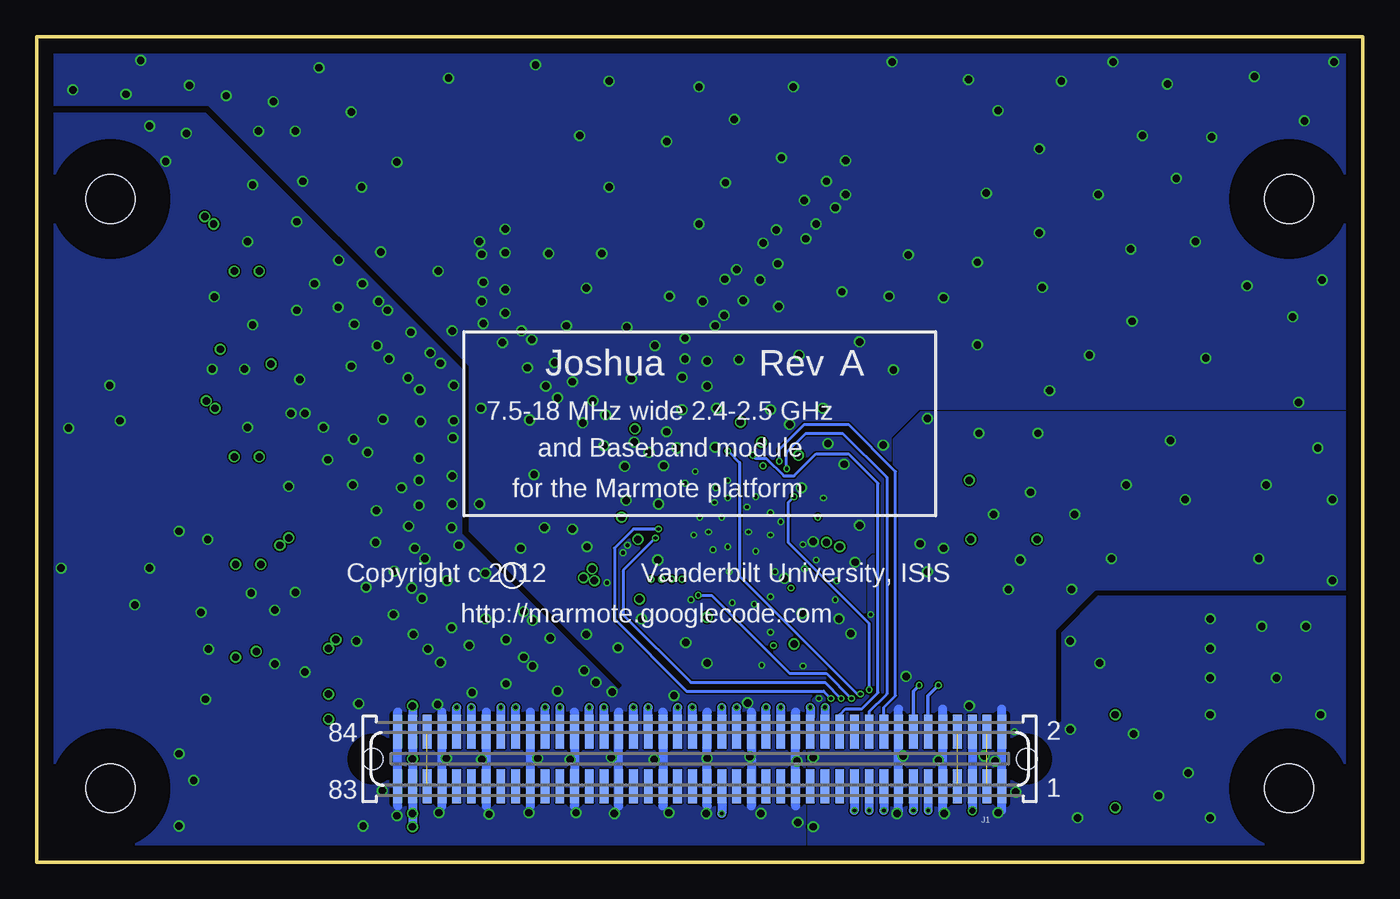
[diagram p12: board, bottom side, seen from below]

Size 90 x 56 mm. Coordinates in mm from the lower left corner, seen from the top.
Outline: 0,0 0,56 90,56 90,0 0,0
Copper layers (1*2*3+14*15*16): SIGNAL1 0.0356mm / dielectric 5mil / GND1 0.0356mm / dielectric 5mil / SIGNAL2 0.0356mm / dielectric 40mil / GND2 0.0356mm / dielectric 5mil / SUPPLY 0.0356mm / dielectric 5mil / GND3 0.0356mm
Design rules: minimum track width 4mil, minimum drill 8mil, track to track 4mil, track to pad 4mil, pad to pad 4mil, via to via 4mil, smd to smd 4mil, copper to edge 40mil, drill to drill 8mil, minimum pad ring 10mil, minimum via ring 4mil, stop-mask expansion 2mil, vias tented up to drill 0.5mm, thermal gap 10mil

### Footprints (pad centres in the part's own frame; a part is rotated, then mirrored left to right if it is on the bottom)
CPOL2012 = smd 1.3 x 1.5: + -0.95,0; - 0.95,0
C0402 = smd 0.9 x 0.7: 1 -0.65,0; 2 0.65,0
C1206 = smd 1.6 x 1.803: 1 -1.422,0; 2 1.422,0
C0805 = smd 1.3 x 1.5: 1 -0.95,0; 2 0.95,0
TSSOP8 = smd 0.35 x 1.2: 1 -0.975,-2.925; 2 -0.325,-2.925; 3 0.325,-2.925; 4 0.975,-2.925; 5 0.975,2.925; 6 0.325,2.925; 7 -0.325,2.925; 8 -0.975,2.925
71742-3003-BOT = smd 0.6 x 2.3: 1 -20.5,1.85; 2 -20.5,-1.85; 3 -19.5,1.85; 4 -19.5,-1.85; 5 -18.5,1.85; 6 -18.5,-1.85; 7 -17.5,1.85; 8 -17.5,-1.85; 9 -16.5,1.85; 10 -16.5,-1.85; 11 -15.5,1.85; 12 -15.5,-1.85; 13 -14.5,1.85; 14 -14.5,-1.85; 15 -13.5,1.85; 16 -13.5,-1.85; 17 -12.5,1.85; 18 -12.5,-1.85; 19 -11.5,1.85; 20 -11.5,-1.85; 21 -10.5,1.85; 22 -10.5,-1.85; 23 -9.5,1.85; 24 -9.5,-1.85; 25 -8.5,1.85; 26 -8.5,-1.85; 27 -7.5,1.85; 28 -7.5,-1.85; 29 -6.5,1.85; 30 -6.5,-1.85; 31 -5.5,1.85; 32 -5.5,-1.85; 33 -4.5,1.85; 34 -4.5,-1.85; 35 -3.5,1.85; 36 -3.5,-1.85; 37 -2.5,1.85; 38 -2.5,-1.85; 39 -1.5,1.85; 40 -1.5,-1.85; 41 -0.5,1.85; 42 -0.5,-1.85; 43 0.5,1.85; 44 0.5,-1.85; 45 1.5,1.85; 46 1.5,-1.85; 47 2.5,1.85; 48 2.5,-1.85; 49 3.5,1.85; 50 3.5,-1.85; 51 4.5,1.85; 52 4.5,-1.85; 53 5.5,1.85; 54 5.5,-1.85; 55 6.5,1.85; 56 6.5,-1.85; 57 7.5,1.85; 58 7.5,-1.85; 59 8.5,1.85; 60 8.5,-1.85; 61 9.5,1.85; 62 9.5,-1.85; 63 10.5,1.85; 64 10.5,-1.85; 65 11.5,1.85; 66 11.5,-1.85; 67 12.5,1.85; 68 12.5,-1.85; 69 13.5,1.85; 70 13.5,-1.85; 71 14.5,1.85; 72 14.5,-1.85; 73 15.5,1.85; 74 15.5,-1.85; 75 16.5,1.85; 76 16.5,-1.85; 77 17.5,1.85; 78 17.5,-1.85; 79 18.5,1.85; 80 18.5,-1.85; 81 19.5,1.85; 82 19.5,-1.85; 83 20.5,1.85; 84 20.5,-1.85 | hole 1.4: -22.2,0; 22.2,0
3,3 = hole 3.3: 0,0
FIDUCIAL-1X2 = smd 1 x 1: 1 0,0
R0402 = smd 0.9 x 0.7: 1 -0.65,0; 2 0.65,0
R0603 = smd 1 x 1.1: 1 -0.85,0; 2 0.85,0
TQFN-48 = smd 0.8 x 0.3: 1 -3.5,2.75; 2 -3.5,2.25; 3 -3.5,1.75; 4 -3.5,1.25; 5 -3.5,0.75; 6 -3.5,0.25; 7 -3.5,-0.25; 8 -3.5,-0.75; 9 -3.5,-1.25; 10 -3.5,-1.75; 11 -3.5,-2.25; 12 -3.5,-2.75; 25 3.5,-2.75; 26 3.5,-2.25; 27 3.5,-1.75; 28 3.5,-1.25; 29 3.5,-0.75; 30 3.5,-0.25; 31 3.5,0.25; 32 3.5,0.75; 33 3.5,1.25; 34 3.5,1.75; 35 3.5,2.25; 36 3.5,2.75 | smd 0.3 x 0.8: 13 -2.75,-3.5; 14 -2.25,-3.5; 15 -1.75,-3.5; 16 -1.25,-3.5; 17 -0.75,-3.5; 18 -0.25,-3.5; 19 0.25,-3.5; 20 0.75,-3.5; 21 1.25,-3.5; 22 1.75,-3.5; 23 2.25,-3.5; 24 2.75,-3.5; 37 2.75,3.5; 38 2.25,3.5; 39 1.75,3.5; 40 1.25,3.5; 41 0.75,3.5; 42 0.25,3.5; 43 -0.25,3.5; 44 -0.75,3.5; 45 -1.25,3.5; 46 -1.75,3.5; 47 -2.25,3.5; 48 -2.75,3.5 | smd 5.6 x 5.6: 49 0,0
LDB21-FOOTPRINT = smd 0.7 x 0.3: 1 -0.65,0.65; 2 -0.65,0; 3 -0.65,-0.65; 4 0.65,-0.65; 5 0.65,0; 6 0.65,0.65
MSOP8 = smd 0.4 x 1.1: 1 -0.975,-2.25; 2 -0.325,-2.25; 3 0.325,-2.25; 4 0.975,-2.25; 5 0.975,2.25; 6 0.325,2.25; 7 -0.325,2.25; 8 -0.975,2.25
SOIC8 = smd 0.6 x 2.2: 1 -1.905,-2.6; 2 -0.635,-2.6; 3 0.635,-2.6; 4 1.905,-2.6; 5 1.905,2.6; 6 0.635,2.6; 7 -0.635,2.6; 8 -1.905,2.6
SMA-SMD = smd 1.73 x 1.73: 1 0,0 | smd 2.35 x 1.9: 2@1 -2.375,2.6; 2@2 -2.375,-2.6; 2@3 2.375,-2.6; 2@4 2.375,2.6 | smd 1.5 x 3.4: 2@5 -2.8,0; 2@6 2.8,0
FOX924 = smd 1.6 x 1.3: 1 -2,-1.25; 2 2,-1.25; 3 2,1.25; 4 -2,1.25

### Placement (x,y rotation side)
C41  78.8,47.7 0 top
C42  79.1,45.7 0 top
C43  79.1,44.7 0 top
C45  77.2,13 0 top
C51  82.8,32.3 0 top
C52  80.1,32.9 90 top
C53  79.1,32.9 90 top
C61  70,24 90 top
C62  71.9,23.6 90 top
C63  72.9,23.6 90 top
C64  79.2,41.2 90 top
C67  72.9,34.7 180 top
C71  71.5,17 0 top
C72  71.8,15.1 0 top
C73  71.8,14.1 0 top
C74  79.2,28.6 90 top
C101  55.55,20.5 90 top
C102  53.7,20.85 90 top
C103  50,22.5 315 top
C104  41.4,29.5 135 top
C105  48.05,32.1 270 top
C106  49.6,31 270 top
C107  39.9,28.2 135 top
C108  49,20.9 315 top
C109  45.8,16.5 315 top
C110  47.3,17.3 315 top
C111  37.6,27.1 135 top
C112  35,22.1 225 top
C113  35.6,20.1 225 top
C114  36.5,15.2 225 top
C115  37.4,13.75 225 top
C116  36.8,17.7 225 top
C117  40.1,16.6 225 top
C118  39.3,18.1 225 top
C119  33.7,23.8 225 top
C120  36.5,25.9 135 top
C121  33.9,17.7 180 top
C122  29.6,17.7 0 top
C123  28,26.9 90 top
C124  29.6,26.4 90 top
C125  30.6,26.4 90 top
C126  25.4,20.6 180 top
C127  25.9,19 180 top
C128  25.9,18 180 top
C129  21.1,20.6 180 top
C130  21.6,19 180 top
C131  21.6,18 180 top
IC1  13.5,7 270 top
J1  45,7 180 bottom
LOGO4  2,27 0 top
LOGO5  14,39 0 top
LOGO6  14,27 0 top
LOGO7  40.5,35.5 0 top
M1  5,45 0 top
M2  85,45 0 top
M3  5,5 0 top
M4  85,5 0 top
M5  2,2 0 top
M6  2,48 0 top
M7  88,48 0 top
M8  88,2 0 top
R1  17.8,8.4 90 top
R2  17.8,4.3 270 top
R3  38.4,5.7 0 top
R4  38.4,3.7 0 top
R41  80.1,11.8 90 top
R42  78.8,18.8 0 top
R43  80.1,14.8 90 top
R44  78.8,20.3 180 top
R45  75.7,15.8 180 top
R46  75.7,22.8 180 top
R47  72.6,19.3 180 top
R48  72.6,20.3 180 top
R51  69.85,3.05 90 top
R52  77.8,9.9 180 top
R53  69.85,6.1 90 top
R54  74.8,9.9 180 top
R55  65.8,10.5 90 top
R56  72.8,10.5 90 top
R57  66.6,12.6 180 top
R58  67.6,13.6 180 top
R61  72.6,41.5 0 top
R62  72.6,40.5 0 top
R63  75.7,44.5 0 top
R64  75.7,37.5 0 top
R65  78.2,41.2 270 top
R66  79.2,38.2 270 top
R71  72.6,28.9 0 top
R72  72.6,27.9 0 top
R73  75.7,31.9 0 top
R74  75.7,24.8 0 top
R75  78.2,28.6 270 top
R76  79.2,25.6 270 top
R101  35.9,24.4 315 top
R102  33.8,25.4 225 top
R451  75.2,12.5 90 top
R452  77.2,12 180 top
R671  75.9,34.8 0 top
R672  72.9,35.7 0 top
RA00  12,12.5 0 top
RA01  15,12.5 180 top
RA10  12,14.5 0 top
RA11  15,14.5 180 top
RA20  12,16.5 0 top
RA21  15,16.5 180 top
RWP0  12,10 0 top
RWP1  15,10 180 top
U1  42.8,22.9 225 top
U2  48.8,25.8 315 top
U3  45.4,29.2 315 top
U4  75.7,19.3 180 top
U5  69.3,10.5 90 top
U6  75.7,41 0 top
U7  75.7,28.4 0 top
U8  24,13 0 top
U9  29.5,13 0 top
X1  59,47.2 0 top
X2  31,47.2 90 top
X3  29.6,21.7 270 top
X4  85,12.4 90 top
X5  75,5 90 top
X6  85,37.6 90 top
X7  85,25 90 top

### Tracks (layer width: path | path; a pad name or v marks a point on that pad's centre or on a via)
!CS  (via drill 0.25)
  SIGNAL1 0.203: v41.4,27.6 41.2,27.4 41.2,27 41.4,26.8 U1.15
  GND3 0.203: v41.4,27.6 41.2,27.4 40.5,27.4 39.3,26.2 38.6,26.2 37.1,27.7 34.9,27.7 32.9,25.7 32.9,11.5 34,10.4 35.1,10.4 35.5,10 J1.24
!SHDN  (via drill 0.25)
  SIGNAL1 0.203: v43.1,27.9 43.5,27.5 U1.12 | v34.1,11.4 33.1,10.4 33.1,6.1 v30.5,3.5
  GND3 0.203: v43.1,27.9 42.3,27.1 42.3,19.4 34.3,11.4 v34.1,11.4
  GND3 0.61: J1.13 v30.5,3.5
A0
  SIGNAL1 0.305: RA01.2 RA00.2 12.65,12.15 12,11.5 10.6,11.5 9.6,10.5 9.6,8.45 10.05,8 10.15,8 10.18,7.97 IC1.1
A1
  SIGNAL1 0.305: RA11.2 RA10.2 12.65,14.15 12,13.5 10.35,13.5 8.95,12.1 8.95,8.25 9.88,7.33 IC1.2
A1V5  (1 unrouted)
A2
  SIGNAL1 0.305: RA21.2 RA20.2 12.65,16.15 12,15.5 10,15.5 8.3,13.8 8.3,8 9.62,6.67 IC1.3
A3V3  (via drill 0.5)
  SIGNAL1 0.203: C106.2 49.5,30.35 49.5,30.2 | 49.5,30.2 49.5,30 | 49.4,30 49.6,30 C106.2 | 49.5,30.2 49.6,30.2 C106.2 | 48.5,30.2 48.2,30.2 | 48.2,30.2 48.2,30 | 48.2,30.2 48.05,30.2 C105.2 | C102.1 53.7,19.7 53.5,19.5 | v52.3,19.9 52.3,19.7 52.5,19.5 | 49.2,23.1 49.4,23.1 C103.1 49.7,22.8 | 49.7,22.8 | 48.7,21.4 48.58,21.4 C108.1 48.5,21.4 48.2,21.4 | 46.35,17.85 46.75,17.85 C110.1 | 45,17.1 45.2,17.1 C109.1 45.3,17 45,17 | 44.6,16.6 v44.5,16.6 | C123.1 26.75,25.95 v26.7,25.9 | C124.1 29.95,25.75 30.1,25.9 | 30.55,25.9 30.55,25.8 C125.1 30.6,25.4 | 30.6,24.5 30.6,24.15 X3.4 | 27.6,16.6 27.6,16.2 U9.8 | C127.1 26.6,18.2 C128.1 26.8,18 26.8,17.8 | C126.1 26.55,20.75 v26.6,21.9 | v22.1,21.9 C131.1 22.2,18.05 v22.1,21.9 | v22.1,21.9 22.15,19.2 C130.1 | C129.1 22.15,20.95 v22.1,21.9 | 37.3,15.2 C114.1 | 38.1,14.4 C115.1 | 38.5,14.8 v38.6,14.8 | 37.4,18.7 C116.1 37.3,18.3 | 36.5,20.7 C113.1 36.1,20.9 | 35.8,21.5 v35.5,21.4 | 36.1,21.8 v36.4,21.7 | 35.3,22.3 C112.1 35.7,22.7 | 38.3,22.3 U1.25 | C111.1 38,27 | 38.4,27.4 v38.3,27.6 | 40.3,27.4 C107.1 40.35,28.15 | 40.6,28.4 v40.8,28.5 | 42.15,27.44 42,27.6 | 42,28.9 C104.1 41.65,29.25 | C62.1 C63.1 | 72.9,23.1 C63.1 | C63.1 72.9,22.5 | R451.2 75.1,13.5 | 75.1,14.1 v75.1,14.3 | C72.1 70.9,15 | 70.9,14.5 C73.1 | 70.9,16.9 C71.+ | C51.+ 81.4,32.1 | C52.1 C53.1 79.3,32.1 | v77.55,34.8 77.3,34.8 | 76.9,34.8 R671.2 | 78.6,44.5 C43.1 78.3,44.9 C42.1 | 78.3,47 C41.+ | 70.2,23.1 C61.+ | U1.1 47.2,23.4 | C101.+ 55.5,19.5
  SIGNAL1 0.305: 48.2,30.15 48.2,30 48.2,28.65 U1.7 | v49.4,29.4 49.4,30 | U1.13 42.15,27.44 | 42,27.6 42,28.9 | v42.25,29.85 41.65,29.25 | 36.1,20.9 36.1,21.5 35.8,21.5 | U1.17 40.1,26.66 40.1,27.2 40.3,27.4 | 40.2,28 40.35,28.15 40.6,28.4 | 38,27 38.4,27.4 | v49.2,21.9 48.7,21.4 | 35.7,22.7 36,22.4 38.2,22.4 38.3,22.3 | 37.4,18.7 38.6,19.9 39.4,19.9 40.1,20.6 U1.30 | 45,17.1 44.5,17.6 44.5,18.73 U1.39 | U1.41 45.6,19.04 45.6,18.6 46.35,17.85 v49.1,17.85 | U1.1 47.29,23.5 | 47.2,23.4 48.9,23.4 49.2,23.1 | 48.2,21.4 48,21.2 46.98,21.2 U1.46 | 44.6,16.6 45,17 | 36.1,21.8 35.8,21.8 35.3,22.3 | 36.5,20.7 36.8,21 38.42,21 U1.27 | 37.3,18.3 37.3,15.2 38.1,14.4 | 49.5,30.2 48.5,30.2 | 49.7,22.8 v50.3,23.4 | U1.20 38.06,26.58 C111.1
  SIGNAL1 0.406: v76.6,40.1 76.03,39.52 U6.3 | v76.6,27.5 76.03,26.93 U7.3 | v74.8,20.2 75.38,20.77 U4.3 | v70.2,11.4 70.78,10.82 U5.3 | 75.1,13.5 75.1,14.1 | 38.1,14.4 38.5,14.8
  SIGNAL1 0.61: 26.6,18.2 v26.6,21.9 | 26.8,17.8 27.6,17 27.6,16.6 | U8.8 v22.1,21.9 | 30.55,25.9 30.1,25.9 v26.7,25.9 | 30.6,25.4 30.6,24.5 | 76.9,34.8 77.3,34.8 | 78.1,43.3 v78.6,43.8 78.6,44.5 | 78.3,44.9 78.3,47 | 81.4,32.1 79.3,32.1 v78.5,31.3 78,30.8 | 70.2,23.1 72.9,23.1 | 72.9,22.5 v72.9,22 73.4,21.5 | 70.9,16.9 70.9,15 70.9,14.5 v70.2,14.5 69.7,15
  SIGNAL1 1.27: 55.5,19.5 53.5,19.5 52.5,19.5 52.3,19.5
  GND3 0.61: J1.82 J1.81 v64.5,3.3 v64.5,2.4 | v64.5,10.6 64.5,9.85
  other vias: 52.15,19.1 64.5,7 52.9,19.3 78,43.3 77.9,30.8 73.5,21.5 69.7,15.1
  pour SUPPLY: 35.1,25.1 38,28 39.8,28 42.3,30.5 49.1,30.5 51.5,28.1 51.5,19.7 49.3,17.5 46.2,17.5 43.2,14.5 38.3,14.5 37.9,14.9 37.9,18.5 35.1,21.3
  pour SUPPLY: 76.9,39.8 76.3,39.8 76.3,42 78.6,44.3 79.7,44.3 81.8,42.2 81.8,25.8 79.5,23.5 73.9,23.5 72.9,22.5 75.3,20.1 74.8,19.6 72.4,22 71.1,20.7 71.1,18.7 75.5,14.3 75.1,13.9 70.7,18.3 68.8,16.4 70.5,14.7 70.5,11.1 69.9,11.1 69.9,14.3 68.3,15.9 65.5,13.1 65.5,1.5 63.5,1.5 63.5,13.5 69.5,19.5 69.5,21.5 72.9,24.9 78.9,24.9 80.5,26.5 80.5,31.7 79.3,31.7 76.9,29.3 76.9,27.2 76.3,27.2 76.3,29.6 79.3,32.6 80.5,32.6 80.5,34.5 77.3,34.5 77.3,35.1 80.5,35.1 80.5,42.1 79,43.6 78.8,43.6 76.9,41.7
  pour SUPPLY: 63.7,10 63.7,8.5 51.9,8.5 48.5,11.9 48.5,15.5 51.9,18.9 51.9,19.3 51.5,19.7 51.5,21.3 53.2,19.6 53.2,18.2 50,15 50,12 52,10
  pour SUPPLY: 21.5,22.5 26,22.5 26,26.5 27.5,26.5 27.5,20.5 33,15 33,12.5 35.1,10.4 37.6,10.4 42,6 63.5,6 63.5,4 41,4 36.5,8.5 34,8.5 31,11.5 31,14 24,21 21.5,21
ADC3+  (via drill 0.25)
  SIGNAL1 0.203: 71.8,19.4 R47.2
  SIGNAL1 0.305: 71.8,19.4 67.4,19.4 v58.5,10.5
  GND3 0.61: J1.70 v58.5,10.5
ADC3-  (via drill 0.25)
  SIGNAL1 0.203: R48.2 72,20.2
  SIGNAL1 0.305: v57.5,10.5 67.2,20.2 72,20.2
  GND3 0.61: J1.68 v57.5,10.5
ADC4+  (via drill 0.25)
  SIGNAL1 0.203: 65.7,12.7 R57.2
  SIGNAL1 0.305: 65.7,12.7 63.7,12.7 v61.5,10.5
  GND3 0.61: J1.76 v61.5,10.5
ADC4-  (via drill 0.25)
  SIGNAL1 0.203: R58.2 66.7,13.5
  SIGNAL1 0.305: 66.7,13.5 63.5,13.5 v60.5,10.5
  GND3 0.61: J1.74 v60.5,10.5
AGND  (via drill 0.25, 0.5)
  SIGNAL1 0.305: 38.72,22.02 U1.26 38.32,21.6 37.7,21.6 | U1.2 47.48,24.4 | U1.31
  GND3 0.61: 65.5,3.8 65.5,10.2 | 62.5,3.8 62.5,10.2 | 59.5,10.2 59.5,3.8 | 56.5,3.8 56.5,10.2 | 53.5,10.2 53.5,3.8 | 50.5,3.8 50.5,10.2 | 47.5,10.2 47.5,3.8 | 44.5,3.8 44.5,10.2 | 41.5,10.2 41.5,3.8 | 38.5,3.8 38.5,10.2
  other vias: 43.1,25.9 43.1,24.7 44.4,22.4 41.7,22.4 41.8,24.1 39.5,23.1 41.2,24.8 44,24.4 43.9,25.4 45,23.4 40.2,23.7 45.4,22.2 43,19.7 40.2,22.2 43.5,23.4 44.1,21.2 48.05,35.05 37.3,21.75 39.25,19.25 47.8,24.3 44.5,13.5 40.2,30.7 35.2,27 45.95,14.9 47.85,20.5 48.95,16.5 66.55,4.85 62.2,7.05 59.8,6.95 56,7.05 53.8,6.95 51,7.1 48.1,6.95 44.5,7.05 41.6,7.15 43.85,30.8 43.95,28.15 34.15,22.85 34.45,20.35 49.65,32.8 50.55,14.55 44.5,32.3 46.2,30.7 46.2,32.9 40.9,39.5 39.7,40.6 37.8,42.3 37.1,43.3 35.8,44.4 35.1,45.3 42.5,40.2 40.7,42 39.8,42.9 37.9,44.9 36.4,46.2 35.1,47.6 50.1,26.85 49.45,28.5 52.7,38.95 58.2,38.85 58.2,41.35 58.2,42.95 51.5,28.25 61.8,36.05 59.8,38.05 59.7,39.35 59.8,41.25 43.3,39.55 75.7,42.1 75.7,29.5 75.45,18.25 66.95,23.85 62.8,10.7 62.6,13.55 60.45,11.5 71.8,12.9 61.8,24.3 58.15,12.1 61.85,15.9 63.85,17.9 64.55,18.6 67,21.7 61.8,26.2 68.5,28.7 72.9,25.5 65.8,16.8 78.4,21.9 68.3,15 78.55,11.05 72.15,32.75 73.85,13.45 64.05,25.9 63.95,29.9 70.25,27.3 72.75,30.45 54.65,11.6 56.35,13.3 56.95,13.9 58.15,15.1 59.55,16.5 62.15,19.1 63.65,20.6 64.35,21.3 64.75,22.8 68.55,25.6 70.55,29.5 52.05,12.2 52.85,13 55.15,15.2 56.35,16.4 56.95,17 59.55,19.6 61.35,21.5 61.85,22.7 64.05,24.2 65.25,25.4 67.55,27.8 68.45,36.5 64,32.05 71.8,30.45 75.9,33.45 62.6,33.85 66.5,30.05 71.15,39.25 66.1,34.15 64.8,32.85 66.9,35.05 61.7,29.95 61.7,32.35 1.95,54.3 10.25,49.2 13.25,52.8 16.95,54.3 20.45,53 26.75,53.1 31.95,54.3 38.65,52.6 45.05,52.6 51.15,53 56.15,54.1 62.05,53.2 70.85,53.9 68.65,50.9 73.95,51.6 79.65,52.7 82.95,54.4 87.55,52.4 3.95,50.3 7.35,53.3 14.95,49.3 21.95,48.4 24.75,51 43.25,46.1 47.25,48.9 53.15,49.3 65.55,47.5 67.95,45.8 71.95,46.2 77.15,52 83.95,52.1 12.65,46.4 21.95,42.7 25.55,45.4 39.45,47.8 59.95,42.1 51.15,45.8 66.65,41.4 74.95,49.6 72.45,49.6 2.75,39.5 15.75,41.6 35.35,38.7 26.15,40.7 30.85,41.2 62.75,40.1 4.75,37 10.65,34.2 15.65,36.7 21.75,39 49.95,36.3 64.05,27.4 4.35,31.2 59.85,30.8 59.95,24.3 55.55,22.7 60.65,14.7 56.25,26.3 52.7,15.45 38.35,2.7 40.85,3.3 44.55,3.3 35.55,16.5 38,21.55 38.9,29.7 38.1,25.4 36.3,28.4 47.1,3.35 50.8,3.3 53.4,3.35 56.6,3.35 59.3,3.25 62.7,3.35 64.45,15.45 63.45,14.45 65.55,3.15 46.75,11.3 41.75,10.8 50.95,11.55 56.55,30 61.75,28.8 51.65,41.3 55.25,41.3 54.05,36.4 47.05,38.4 45.05,43.3 42.65,50.4 39.65,37.7 38.25,34.4 34.15,35.3 32.15,38.4 26.15,35.1 28.45,38.3 11.35,42.1 7.85,39.1 21.25,32 42.35,34.1 49.9,21.5 50.2,21 38.4,6.85 43.1,21.4 41.2,21.1 42.8,17.6 40.8,13.35 41.3,17.5 39.9,19.7 37.9,19.9 37.1,20.5 35.7,19.1 35.8,17.8 45.6,17.8 36.6,24.7 40.2,18 51.4,30.35 52.95,29.8 52.25,31.3 53.65,32.6 55.45,32.3 54.65,31.5 54.85,33.9 56.4,35.45 56.7,33.55 58.4,35.25 57.1,36.05 59.7,36.55 58.2,37.25 40.2,15.6 38,13.3 34.75,15.5 38.05,16.9 47.25,29.2 46.55,28.1 48.45,27.8 47.45,26.9 45.3,26.5 46,25.7 50,24.55 53.65,22.6 57.15,21.3 52.65,21.4 51.3,18.95 44.8,38.05 46,35.55 46,34.15 44.5,34 43.95,36.4 43.35,37.1 42.05,38.1 36.65,30.8 32.55,28.3 31.85,33.4 18.55,34.4 17.95,45.3 78.35,14.45 80.35,7.35 68.15,10.75 69.55,37.65 85.05,32.35 77.95,38.35 78.85,16.95 67.65,18.65 87.85,29.45 84.35,29.95 65.75,19.75 88.35,19.95 80.35,22.45 82.35,19.95 68.65,33.65 83.35,17.45 79.35,5.55 80.35,2.45 67.85,2.45 63.3,34.55 64.6,35.95 66.2,37.45 66.8,38.05 67.9,39.25 69.5,40.85 75.35,36.45 82.35,49.95 75.35,45.95 72.35,43.45 72.35,37.45 79.85,49.45 81.25,47.55 73.85,17.1 72.45,18.3 78.1,33.45
  pour SIGNAL1 (rank 2): 0,56 90,56 90,0 0,0
  pour SIGNAL2 (rank 2): 0,56 90,56 90,0 0,0
  pour GND1 (rank 2): 0,56 90,56 90,0 0,0
  pour GND3 (rank 2): 0,56 90,56 90,0 0,0
  pour GND2 (rank 2): 0,56 90,56 90,0 0,0
  pour SUPPLY (rank 3): 0,56 90,56 90,0 0,0
ANTSEL  (via drill 0.25)
  SIGNAL1 0.203: v48,22 47.7,21.7 47.2,21.7 47.1,21.8 U1.47 | v35.4,11.1 34.3,10 34.3,4.3 v33.5,3.5
  GND3 0.203: v48,22 50.2,19.8 50.2,16.8 45.6,12.2 36.5,12.2 v35.4,11.1
  GND3 0.61: J1.19 v33.5,3.5
BYPASS
  SIGNAL1 0.203: 40.8,17.35 C117.1 | 41.1,19.43 U1.33
  SIGNAL1 0.305: 40.8,17.35 40.8,19.13 41.1,19.43
CLK1  (via drill 0.25)
  SIGNAL1 0.203: U9.2 28.86,10.54 28.8,11.4 | U8.2 23.3,11.6
  SIGNAL1 0.254: 23.3,11.6 23.8,12.1 28.7,12.1 v28.8,12 28.8,11.4
  GND3 0.254: J1.12 29.5,11.3 v28.8,12
CLK2  (via drill 0.25)
  SIGNAL1 0.203: 30.1,10.84 U9.3 | U8.3 24.8,9.3
  SIGNAL1 0.254: 24.8,9.3 24.8,9.2 25.3,8.7 29.5,8.7 30,9.2 30,10.8 30.1,10.84 v30.1,12
  GND3 0.254: J1.14 30.5,11.6 v30.1,12
D1V5  (1 unrouted)
D3V3  (via drill 0.41, 0.5)
  SIGNAL1 0.203: v16.8,10 17,10 17,9.2 | 16.9,9.2 17,9.2 | 17,9.2 17,9 | 16.8,8.05 16.43,8.05 IC1.8 | 17.85,9.2 R1.2 | 17.85,3.7 R2.2
  SIGNAL1 0.305: v16.8,3.7 17.85,3.7 | 16.9,9.2 17.85,9.2
  SIGNAL1 0.61: RWP1.1 v16.8,10 | RA21.1 16.8,15.35 16.8,14.5 | 16.8,8.05 v16.8,10 | 16.8,12.5 16.8,14.5 | v16.8,10 16.8,12.5 | 16.8,14.5 RA11.1 | 16.8,12.5 RA01.1
  SUPPLY 0.61: v26.5,3.5 25.35,2.15 18.35,2.15 v16.8,3.7 v16.8,10
  GND3 0.61: J1.6 J1.5 26.5,4 v26.5,3.5
DAC3+  (via drill 0.25)
  SIGNAL1 0.203: R62.1 71.9,40.6
  SIGNAL1 0.305: v52.5,10.5 63.3,21.3 63.3,32.4 71.5,40.6 71.9,40.6
  GND3 0.61: J1.58 v52.5,10.5
DAC3-  (via drill 0.25)
  SIGNAL1 0.203: 71.8,41.4 R61.1
  SIGNAL1 0.305: v51.5,10.5 62.5,21.5 62.5,32.8 71.1,41.4 71.8,41.4
  GND3 0.61: J1.56 v51.5,10.5
DAC4+  (via drill 0.25)
  SIGNAL1 0.203: R72.1 71.8,28
  SIGNAL1 0.305: v55.5,10.5 66.2,21.2 66.2,24.3 69.9,28 71.8,28
  GND3 0.61: J1.64 v55.5,10.5
DAC4-  (via drill 0.25)
  SIGNAL1 0.203: 71.8,28.8 R71.1
  SIGNAL1 0.305: v54.5,10.5 65.5,21.5 65.5,24.7 69.6,28.8 71.8,28.8
  GND3 0.61: J1.62 v54.5,10.5
DGND  (via drill 0.25, 0.5)
  GND3 0.61: 24.5,3.5 24.5,10.4 | 28.5,3.5 28.5,10.4 | 31.5,3.5 31.5,10.4
  other vias: 10.35,10 10.35,14.5 10.35,16.5 10.35,12.5 11.85,6.05 23.55,4.75 23.65,8.85 31,12.6 26.7,10.6 31.6,3.3 28.4,3.3 24.75,3.35 24.95,6.85 28.8,6.9 31.2,7.2 6.85,16 5.85,12.5 3.85,16 2.85,10 13.85,4.5 10.35,3 19.35,3 19.85,9 37.3,2.4 37.3,7.1 25.7,7.2 36.9,11.1 33.4,16.8 15.55,8.7 3.05,28.1 2.05,24.6 6.55,25.6 13.05,28.6 16.05,25.6 12.05,24.6 22.55,25.1 22.05,29.1 26.05,29.1 29.55,30.1 30.05,21.6 25.05,23.6 19.55,23.6 17.05,20.6 7.05,20.6 2.05,19.1 19.85,15 17.85,13.5 23.25,20.5 24.05,18.5 19.75,18.5 28.45,21.3 29.55,19.7
  pour SIGNAL1: 0,0 37.6,0 37.6,10.7 36.4,11.9 35.1,11.9 33.5,13.5 33.5,20.5 31.8,22.2 31.8,28.7 30,30.5 0,30.5
  pour GND1: 0,0 37.6,0 37.6,10.7 36.4,11.9 35.1,11.9 33.5,13.5 33.5,20.5 31.8,22.2 31.8,28.7 30,30.5 0,30.5
  pour SIGNAL2: 0,0 37.6,0 37.6,10.7 36.4,11.9 35.1,11.9 33.5,13.5 33.5,20.5 31.8,22.2 31.8,28.7 30,30.5 0,30.5
  pour GND3: 0,0 37.6,0 37.6,10.7 36.4,11.9 35.1,11.9 33.5,13.5 33.5,20.5 31.8,22.2 31.8,28.7 30,30.5 0,30.5
  pour SUPPLY (rank 2): 0,0 37.6,0 37.6,10.7 36.4,11.9 35.1,11.9 33.5,13.5 33.5,20.5 31.8,22.2 31.8,28.7 30,30.5 0,30.5
  pour GND2: 0,0 37.6,0 37.6,10.7 36.4,11.9 35.1,11.9 33.5,13.5 33.5,20.5 31.8,22.2 31.8,28.7 30,30.5 0,30.5
DIN  (via drill 0.25)
  SIGNAL1 0.203: v39.1,26.7 39.1,26.3 40,25.4 U1.19
  GND3 0.203: v39.1,26.7 39.1,27.8 37.8,29.1 35.3,29.1 32.3,26.1 32.3,11.4 33.5,10.2 J1.20
I2C_SCL  (via drill 0.25)
  SIGNAL1 0.203: v36.5,10.5 35.5,9.5 35.5,3.4 34.6,2.5 22.8,2.5 18.6,6.7 17.7,6.7 | 17.7,6.7 16.8,6.7 IC1.6 | 17.7,6.7 17.7,7.6 17.8,7.6 R1.1
  GND3 0.203: 36.5,9.9 J1.26
  GND3 0.61: v36.5,10.5 36.5,9.9
I2C_SDA  (via drill 0.25)
  SIGNAL1 0.203: v37.5,10.5 36.1,9.1 36.1,3 35,1.9 22.5,1.9 18.4,6 17.7,6 | 17.7,6 16.8,6 IC1.5 | 17.7,6 17.7,4.95 R2.1
  GND3 0.203: 37.5,9.8 J1.28
  GND3 0.61: v37.5,10.5 37.5,9.8
LD  (via drill 0.25)
  SIGNAL1 0.203: v38.6,24.8 38.6,24.6 38.9,24.3 U1.22 | v33.5,11.7 32.5,10.7 32.5,6.5 v29.5,3.5
  GND3 0.203: v38.6,24.8 39,24.4 39,21.7 33.5,16.2 v33.5,11.7
  GND3 0.61: J1.11 v29.5,3.5
N$1
  SIGNAL1 0.254: U2.4 48.58,25.1 46.77,25.1 U1.4
N$2
  SIGNAL1 0.254: U1.5 46.76,25.8 U2.3
N$3
  SIGNAL1 0.254: U1.10 44.7,27.27 44.7,28.98 U3.3
N$4
  SIGNAL1 0.254: U1.9 45.4,27.27 U3.4
N$5  (via drill 0.25)
  SIGNAL1 0.203: U1.32 39.73,18.77 | 39.73,18.77 39.55,18.59 | 36.2,24.2 36.45,23.95 | 36.45,23.95 v37,23.4 | v38.8,18.6 39.5,18.6 C118.1 39.73,18.77 | R101.2 36.45,23.95
  SIGNAL2 0.203: v37,23.4 38.5,21.9 38.5,18.9 v38.8,18.6
N$6
  SIGNAL1 0.203: U1.29 39.29,20.45 37.75,20.45 34.9,17.6 C121.1
N$7
  SIGNAL1 0.203: R102.2 33.5,24.9 34,24.4 C119.1
N$8
  SIGNAL1 0.203: U2.1 48.9,26.8
  SIGNAL1 0.356: 48.9,26.8 59,36.9 X1.1
N$9
  SIGNAL1 0.203: 45.2,30.4 45.2,30.32 U3.1
  SIGNAL1 0.356: 45.2,30.4 45.2,36.3 34.3,47.2 X2.1
N$10
  SIGNAL1 0.203: U1.24 37.95,23.86 37.95,24.45 37.11,25.29 C120.1 36.6,25.5 35.9,24.8 R101.1 35.3,24.9 34.4,25.8 R102.1
  SIGNAL1 0.305: U1.24
N$11
  SIGNAL1 0.203: R43.1 80.2,13.9 | R41.2 80.2,12.5
  SIGNAL1 0.406: X4.1 80.2,12.4 80.2,12.5 80.2,13.9
N$12
  SIGNAL1 0.203: R47.1 73.5,18.9 | R45.2 74.72,16.1 | U4.5 74.7,17.7
  SIGNAL1 0.406: U4.5 74.72,16.1 | 73.5,18.9 74.7,17.7
N$13
  SIGNAL1 0.203: R46.2 74.72,22.5 | 73.5,20.3 R48.1 | 74.7,21.5 U4.4
  SIGNAL1 0.406: 73.5,20.3 74.7,21.5 | U4.4 74.72,22.5
N$14
  SIGNAL1 0.203: R45.1 76.67,16.1 76.8,15.7 | 80,15.7 R43.2
  SIGNAL1 0.406: U4.8 76.67,16.1 | 76.8,15.7 80,15.7
N$15
  SIGNAL1 0.203: R46.1 76.67,22.5 | R44.2 77.9,20.5 | U4.1 76.8,21.6
  SIGNAL1 0.406: U4.1 76.67,22.5 | 76.8,21.6 77.9,20.5
N$16
  SIGNAL1 0.203: R53.1 70,5 | 69.85,3.77 R51.2
  SIGNAL1 0.406: 69.85,3.77 R53.1 | X5.1 70,5
N$17
  SIGNAL1 0.406: R44.1 R42.2
N$18
  SIGNAL1 0.203: 66.1,11.47 R55.2 | U5.5 67.2,11.6 | 67.2,12.3 R57.1
  SIGNAL1 0.406: 67.2,12.3 67.2,11.6 | U5.5 66.1,11.47
N$19
  SIGNAL1 0.203: 72.5,11.47 R56.2 | 71.4,11.6 U5.4 | 68.6,13.5 R58.1
  SIGNAL1 0.305: 68.6,13.5 69.5,13.5 71.4,11.6
  SIGNAL1 0.406: 72.5,11.47 U5.4
N$20
  SIGNAL1 0.203: 66.1,9.53 R55.1 | 69.7,7 R53.2
  SIGNAL1 0.406: 66.1,9.53 U5.8 68.17,9.53 69.7,8 69.7,7
N$21
  SIGNAL1 0.203: 73,9.8 R56.1 72.5,9.53 | 73.8,9.8 R54.2
  SIGNAL1 0.406: 72.5,9.53 U5.1 | 73.8,9.8 73,9.8
N$22
  SIGNAL1 0.406: R54.1 R52.2
N$23
  SIGNAL1 0.203: R61.2 73.5,41.7 | R63.1 74.72,44.12 | U6.8 74.7,42.9
  SIGNAL1 0.406: 73.5,41.7 74.7,42.9 | U6.8 74.72,44.12
N$24
  SIGNAL1 0.203: 74.72,37.83 R64.1 | U6.1 74.7,39 | 73.5,40.2 R62.2
  SIGNAL1 0.406: R62.2 73.25,40.33 | 73.5,40.2 74.7,39 | U6.1 74.72,37.83
N$25
  SIGNAL1 0.203: 77.9,41.7 R65.1 | 76.8,42.8 U6.5 | 76.67,44.12 R63.2
  SIGNAL1 0.406: U6.5 76.67,44.12 | 77.9,41.7 76.8,42.8
N$26
  SIGNAL1 0.203: R64.2 76.67,37.83
  SIGNAL1 0.406: U6.4 76.67,37.83
N$27
  SIGNAL1 0.203: 79.2,39 R66.1
  SIGNAL1 0.406: R65.2 C64.1 79.2,39
N$28
  SIGNAL1 0.203: R71.2 73.5,29.1 | R73.1 74.72,31.57 | U7.8 74.7,30.3
  SIGNAL1 0.406: 73.5,29.1 74.7,30.3 | U7.8 74.72,31.57
N$29
  SIGNAL1 0.203: 79.2,37.6 R66.2
  SIGNAL1 0.406: X6.1 79.2,37.6
N$30
  SIGNAL1 0.203: R74.1 74.72,25.12 | U7.1 74.7,26.4 | 73.5,27.6 R72.2
  SIGNAL1 0.406: 73.5,27.6 74.7,26.4 | U7.1 74.72,25.12
N$31
  SIGNAL1 0.203: 77.9,29.1 R75.1 | 76.8,30.2 U7.5 | 76.67,31.57 R73.2
  SIGNAL1 0.406: U7.5 76.67,31.57 | 76.8,30.2 77.9,29.1
N$32
  SIGNAL1 0.203: R74.2 76.67,25.12
  SIGNAL1 0.406: 76.67,25.12 U7.4
N$33
  SIGNAL1 0.203: R76.1 79.2,26.55
  SIGNAL1 0.406: R75.2 C74.1 79.2,26.55
N$34
  SIGNAL1 0.203: 79.5,25 R76.2
  SIGNAL1 0.406: X7.1 79.5,25
N$35
  cutout SIGNAL1: 90.1,51 78.5,51 61,33.5 61,22.4 50.5,11.9 50.4,12 60.8,22.4 60.8,33.6 78.4,51.2 90.1,51.2
  cutout GND1: 90.1,51 78.5,51 61,33.5 61,22.4 50.5,11.9 50.4,12 60.8,22.4 60.8,33.6 78.4,51.2 90.1,51.2
  cutout SIGNAL2: 90.1,51 78.5,51 61,33.5 61,22.4 50.5,11.9 50.4,12 60.8,22.4 60.8,33.6 78.4,51.2 90.1,51.2
  cutout GND2: 90.1,51 78.5,51 61,33.5 61,22.4 50.5,11.9 50.4,12 60.8,22.4 60.8,33.6 78.4,51.2 90.1,51.2
  cutout SUPPLY: 90.1,51 78.5,51 61,33.5 61,22.4 50.5,11.9 50.4,12 60.8,22.4 60.8,33.6 78.4,51.2 90.1,51.2
  cutout GND3: 90.1,51 78.5,51 61,33.5 61,22.3 50.5,11.9 50.4,12 60.8,22.4 60.8,33.6 78.4,51.2 90.1,51.2
N$36
  SIGNAL1 0.203: 30.5,19.1 30.7,19.15 | 30.7,19.15 X3.3 | C122.2 30.5,17.7 | U8.7 23.36,15.3 23.46,14.7 | 32.9,17.6 C121.2 | 30.7,19.15 31.4,19.15 31.4,19.1
  SIGNAL1 0.254: 23.46,14.7 23.46,14.23 24.1,13.6 32.1,13.6 32.9,14.4 32.9,17.6 31.4,19.1 | 30.5,17.7 30.5,19.1
N$39
  SIGNAL1 0.203: C122.1 29.15,17.85 28.9,17.7 | 28.9,16.6 28.9,15.77 U9.7
  SIGNAL1 0.254: 28.9,16.6 28.9,17.7
N$43
  cutout SIGNAL1: 0,18.3 18.1,18.3 20.7,15.7 20.7,9.6 20.6,9.6 20.6,15.6 18,18.2 0,18.2
  cutout GND1: 0,18.3 18.1,18.3 20.7,15.7 20.7,9.6 20.6,9.6 20.6,15.6 18,18.2 0,18.2
  cutout SIGNAL2: 20.7,9.6 20.6,9.6 20.6,15.6 18,18.2 0,18.2 0,18.3 18.1,18.3 20.7,15.7
  cutout GND2: 18.1,18.3 20.7,15.7 20.7,9.6 20.6,9.6 20.6,15.6 18,18.2 0,18.2 0,18.3
  cutout SUPPLY: 20.7,15.7 20.7,9.6 20.6,9.6 20.6,15.6 18,18.2 0,18.2 0,18.3 18.1,18.3
  cutout GND3: 20.7,9.6 20.6,9.6 20.6,15.6 18,18.2 0,18.2 0,18.3 18.1,18.3 20.7,15.7
RSSI  (via drill 0.25)
  SIGNAL1 0.203: v40.7,26.9 40.7,26.8 41,26.5 U1.16 | v40,14.7 40,13.4 38.6,12 38.6,8.6 43.5,3.7 v43.5,3.3
  SIGNAL2 0.203: v40.7,26.9 40.7,15.4 v40,14.7
  GND3 0.61: J1.39 v43.5,3.3
RXBBI+  (via drill 0.25)
  SIGNAL1 0.203: v49.5,10.5 43.8,16.2 43.8,17.9 44,18.1 44,18.5 43.9,18.6 U1.38
  GND3 0.61: J1.52 v49.5,10.5
RXBBI-  (via drill 0.25)
  SIGNAL1 0.203: v48.5,10.5 43.3,15.7 43.3,18.45 U1.37
  GND3 0.61: J1.50 v48.5,10.5
RXBBQ+  (via drill 0.25)
  SIGNAL1 0.203: v46.5,10.5 42.3,14.7 42.3,18.4 U1.36
  GND3 0.61: J1.46 v46.5,10.5
RXBBQ-  (via drill 0.25)
  SIGNAL1 0.203: v45.5,10.5 41.8,14.2 41.8,17.9 41.6,18.1 41.6,18.5 41.7,18.6 U1.35
  GND3 0.61: J1.44 v45.5,10.5
RXHP  (via drill 0.25)
  SIGNAL1 0.203: v45.1,18.1 45.1,18.83 U1.40 | v34.7,11.1 33.7,10.1 33.7,4.7 v32.5,3.5
  GND3 0.203: v45.1,18.1 44.2,18.1 38.9,12.8 36.4,12.8 v34.7,11.1
  GND3 0.61: J1.17 v32.5,3.5
RXTX  (via drill 0.25)
  SIGNAL1 0.203: v47.8,22.6 47.4,22.2 U1.48 | v36.1,11.1 34.9,9.9 34.9,3.9 v34.5,3.5
  GND3 0.203: v47.8,22.6 49.5,22.6 50.8,21.3 50.8,16.5 45.9,11.6 36.6,11.6 v36.1,11.1
  GND3 0.61: J1.21 v34.5,3.5
SCLK  (via drill 0.25)
  SIGNAL1 0.203: v39.6,27.2 39.6,26.5 40.3,25.8 U1.18
  GND3 0.203: v39.6,27.2 39.6,28 37.9,29.7 34.9,29.7 31.7,26.5 31.7,11.3 32.5,10.5 J1.18
TXBBI+  (via drill 0.25)
  SIGNAL1 0.203: v48.3,19.2 46.3,21.2 U1.45
  SIGNAL2 0.203: v43.5,10.5 48.3,15.3 v48.3,19.2
  GND3 0.61: J1.40 v43.5,10.5
TXBBI-  (via drill 0.25)
  SIGNAL1 0.203: v47.6,19.2 45.9,20.9 U1.44
  SIGNAL2 0.203: v42.5,10.5 47.6,15.6 v47.6,19.2
  GND3 0.61: J1.38 v42.5,10.5
TXBBQ+  (via drill 0.25)
  SIGNAL1 0.203: v46.9,19.2 45.6,20.5 U1.43
  SIGNAL2 0.203: v40.5,10.5 46.9,16.9 v46.9,19.2
  GND3 0.61: J1.34 v40.5,10.5
TXBBQ-  (via drill 0.25)
  SIGNAL1 0.203: v46.2,19.2 45.3,20.1 U1.42
  SIGNAL2 0.203: v39.5,10.5 46.2,17.2 v46.2,19.2
  GND3 0.61: J1.32 v39.5,10.5
V_BIAS_ADC  (via drill 0.5)
  SIGNAL1 0.203: 76.5,12.2 R452.2 | 76.5,12.2 76.2,12.1 | 76.5,12.2 C45.1 | 75.5,12.1 R451.1
  SIGNAL1 0.406: 75.5,12.1 76.2,12.1 | v76.5,13.9 76.5,12.2 | v76.5,20.2 76.03,20.68 U4.2 | U5.2 70.67,10.18 v70.2,9.7
  SUPPLY 0.406: v70.2,9.7 72.3,9.7 v76.5,13.9 v76.5,20.2
V_BIAS_DAC  (via drill 0.5)
  SIGNAL1 0.203: 75,34.9 R671.1 | R672.2 73.8,35.4 | 73.8,34.9 C67.1 73.5,34.4
  SIGNAL1 0.406: 75.22,39.77 v74.9,40.1 75.38,39.62 U6.2 | v74.9,27.5 75.38,27.02 U7.2 | 75,34.9 74.5,35.4 73.8,35.4 73.8,34.9 | 73.5,34.4 v74.1,33.8
  SUPPLY 0.406: v74.9,40.1 74.1,39.35 v74.1,33.8 74.1,28.3 v74.9,27.5
VSUP  (1 unrouted)
WP
  SIGNAL1 0.203: RWP1.2 14.35,9.9
  SIGNAL1 0.305: RWP1.2 RWP0.2 | 16.32,7.33 IC1.7 15.32,7.33 14.35,8.29 14.35,9.9

### Text on the board
tPlace: 2.4-2.5GHz | Baseband | TX/RX | RX | DAC3 | DAC4 | EEPROM setup | I2C address | 0 | 1 | A2 | A1 | ADC3 | A0 | write | protection | ADC4
bPlace: Rev | 7.5-18 MHz wide 2.4-2.5 GHz | and Baseband module | for the Marmote platform | Vanderbilt University, ISIS | Copyright c 2012 | http://marmote.googlecode.com